# EasyEDA Pro project SKYSTAR.eprj

# Schematic Schematic1
Board Name: Board1; Create Date: 2025-07-10; Page Name: P1; Project Name: SKYSTAR; Schematic Name: Schematic1; Update Date: 2025-07-25; Company: 嘉立创EDA; Page Size: A4; Version: V1.0
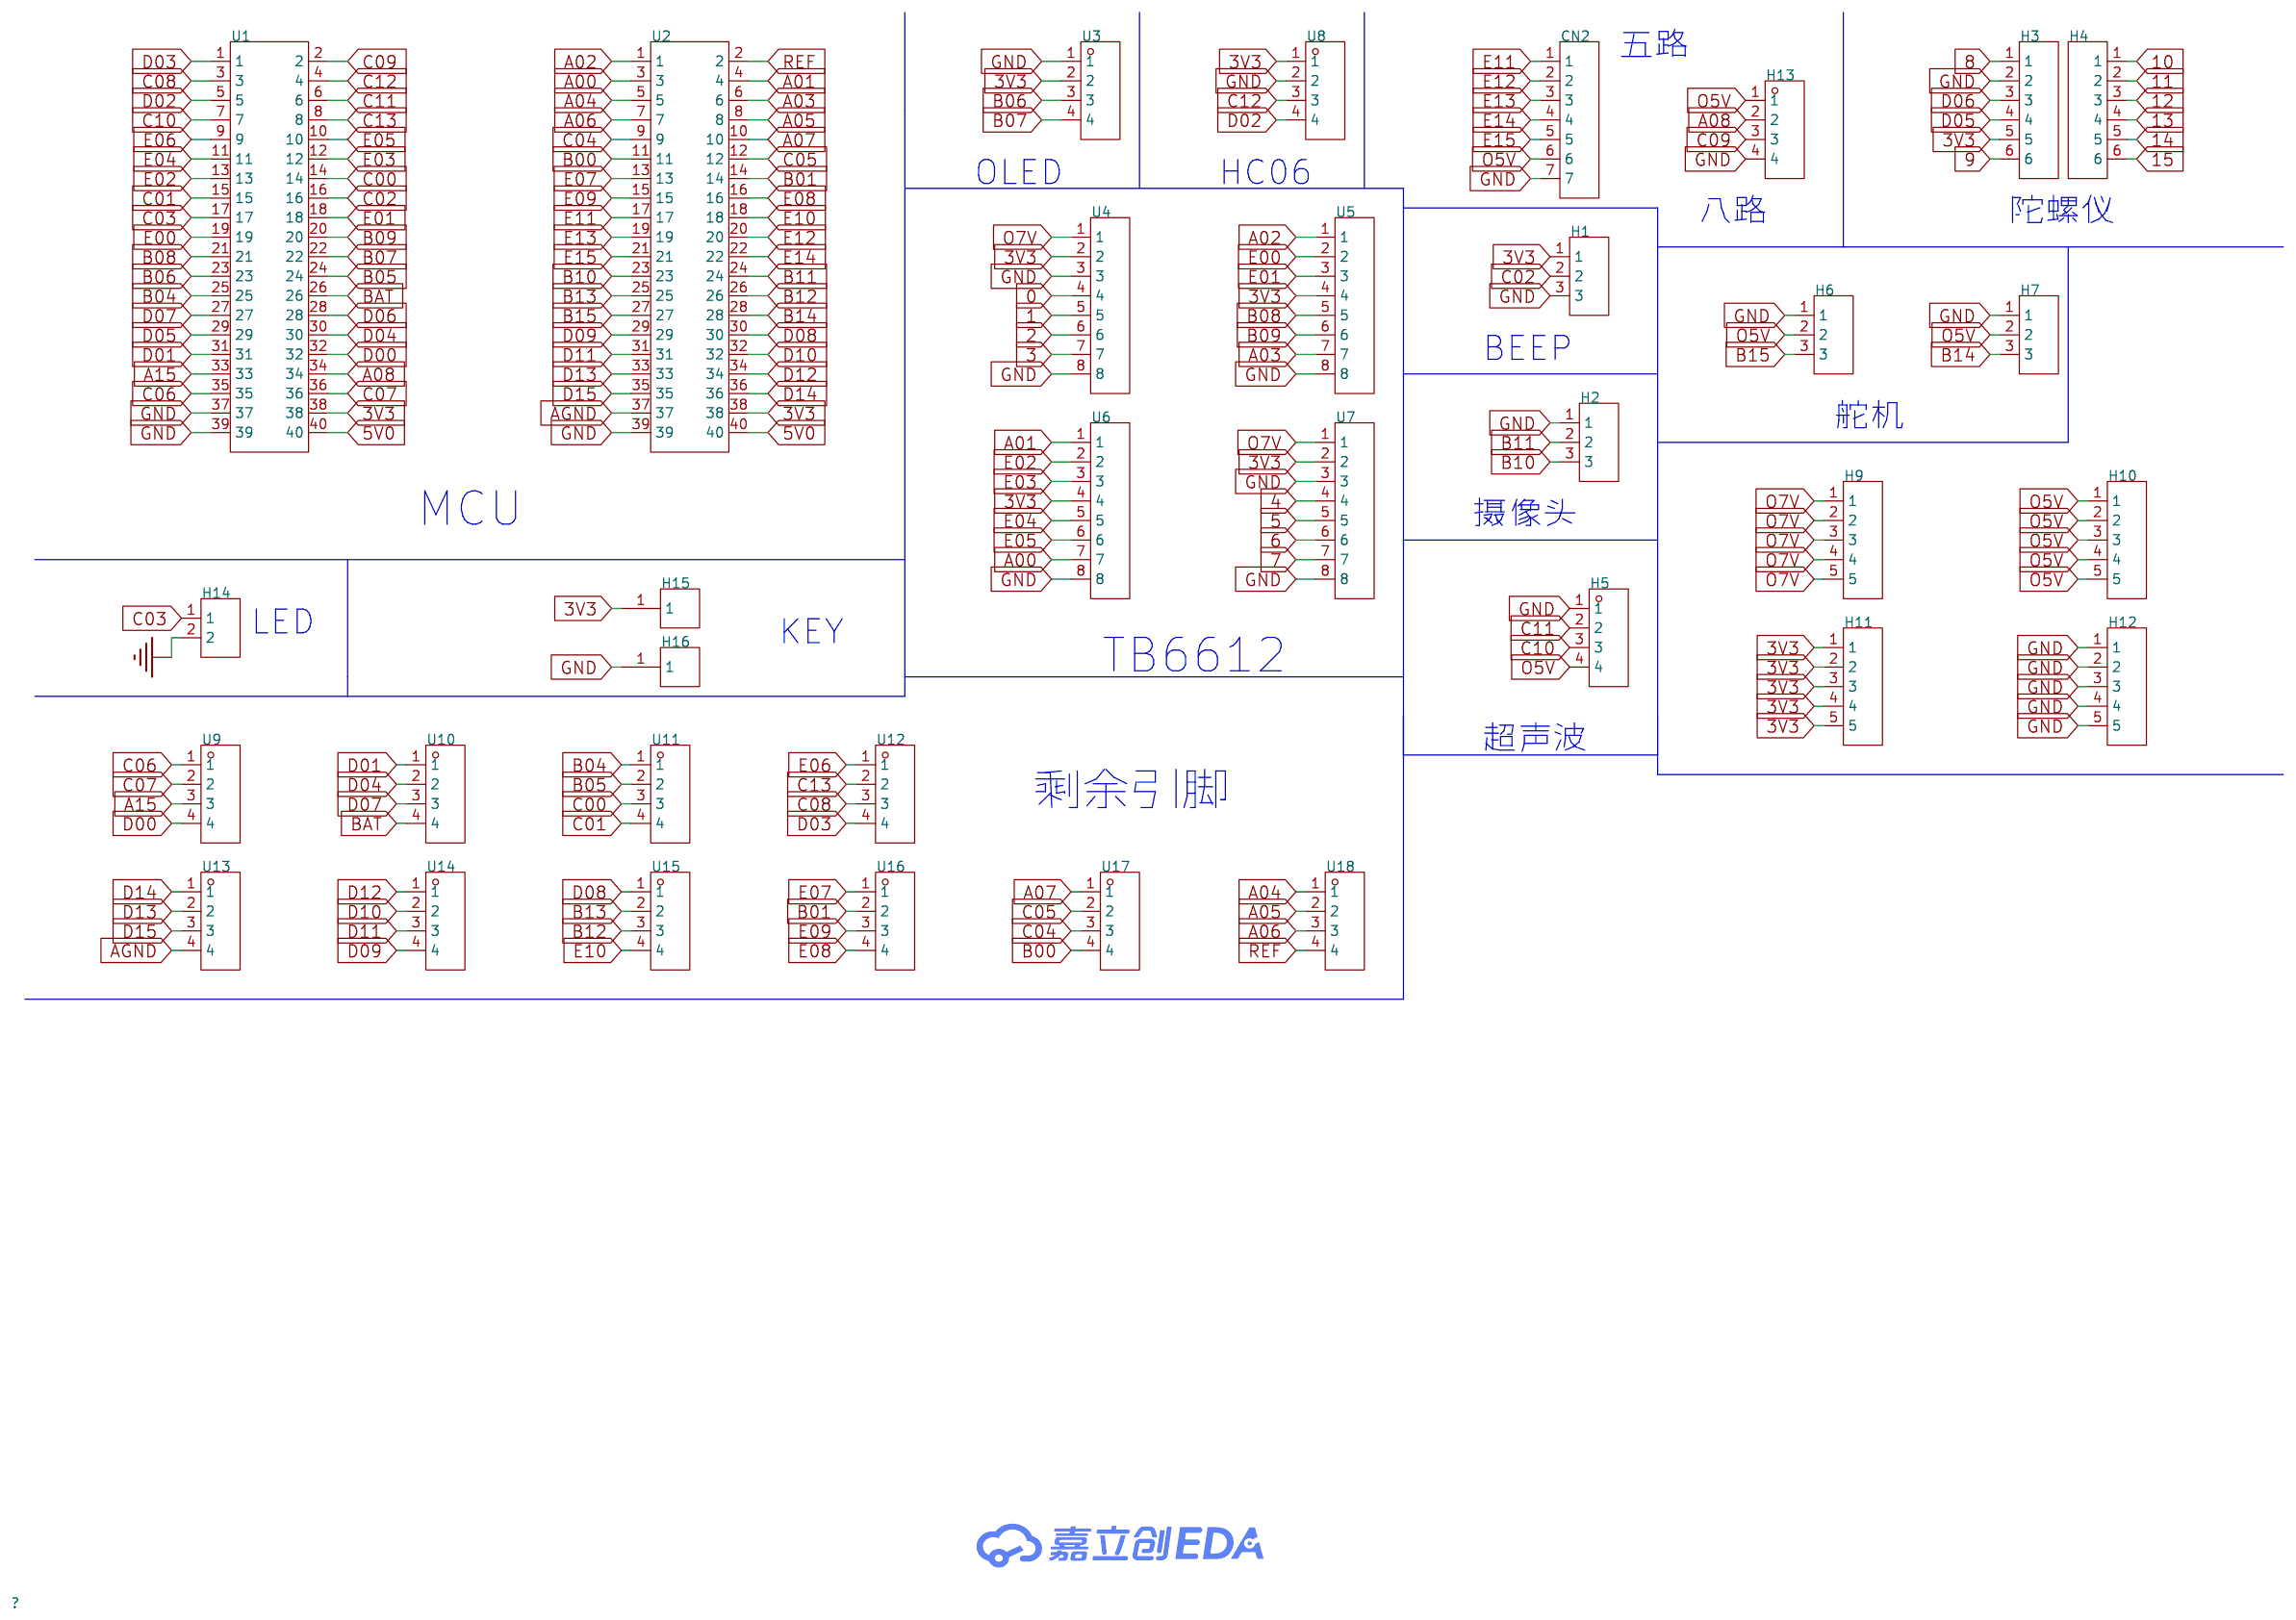
[diagram p0: schematic sheet]

## Parts
CN2  DB2ERC-2.54-7P-GN  [CONN-TH_7P-P2.54_DIBO_DB2ERC-2.54-7P-GN]
H1  PZ254V-11-03P  [HDR-TH_3P-P2.54-V-M]
H2  PZ254V-11-03P  [HDR-TH_3P-P2.54-V-M]
H3  PZ254V-11-06P  [HDR-TH_6P-P2.54-V-M]
H4  PZ254V-11-06P  [HDR-TH_6P-P2.54-V-M]
H5  PZ254V-11-04P  [HDR-TH_4P-P2.54-V-M]
H6  PZ254V-11-03P  [HDR-TH_3P-P2.54-V-M]
H7  PZ254V-11-03P  [HDR-TH_3P-P2.54-V-M]
H9  PZ254V-11-05P  [HDR-TH_5P-P2.54-V-M]
H10  PZ254V-11-05P  [HDR-TH_5P-P2.54-V-M]
H11  PZ254V-11-05P  [HDR-TH_5P-P2.54-V-M]
H12  PZ254V-11-05P  [HDR-TH_5P-P2.54-V-M]
H13  PZ254V-11-04P  [HDR-TH_4P-P2.54-V-M]
H14  PZ254V-11-02P  [HDR-TH_2P-P2.54-V-M]
H15  PZ254V-11-01P  [HDR-TH_1P-P2.54-V-M]
H16  PZ254V-11-01P  [HDR-TH_1P-P2.54-V-M]
U1  PZ2.54-2*20  [HDR-TH_40P-P2.54-V-M-R2-C20-S2.54]
U2  PZ2.54-2*20  [HDR-TH_40P-P2.54-V-M-R2-C20-S2.54]
U3  SIP4-CON4排针  [HDR-TH_4P-P2.54-V-M-3]
U4  2.54-1*8  [HDR-TH_8P-P2.54-V-M]
U5  2.54-1*8  [HDR-TH_8P-P2.54-V-M]
U6  2.54-1*8  [HDR-TH_8P-P2.54-V-M]
U7  2.54-1*8  [HDR-TH_8P-P2.54-V-M]
U8  SIP4-CON4排针  [HDR-TH_4P-P2.54-V-M-3]
U9  SIP4-CON4排针  [HDR-TH_4P-P2.54-V-M-3]
U10  SIP4-CON4排针  [HDR-TH_4P-P2.54-V-M-3]
U11  SIP4-CON4排针  [HDR-TH_4P-P2.54-V-M-3]
U12  SIP4-CON4排针  [HDR-TH_4P-P2.54-V-M-3]
U13  SIP4-CON4排针  [HDR-TH_4P-P2.54-V-M-3]
U14  SIP4-CON4排针  [HDR-TH_4P-P2.54-V-M-3]
U15  SIP4-CON4排针  [HDR-TH_4P-P2.54-V-M-3]
U16  SIP4-CON4排针  [HDR-TH_4P-P2.54-V-M-3]
U17  SIP4-CON4排针  [HDR-TH_4P-P2.54-V-M-3]
U18  SIP4-CON4排针  [HDR-TH_4P-P2.54-V-M-3]

## Library data of the parts
CN2 = DB2ERC-2.54-7P-GN: LCSC Part Name: 2.54mm 1x7P 排数:1 每排P数:7; Supplier Part: C2927508; Manufacturer: DORABO(地博电气); Supplier Footprint: 弯插,P=2.54mm; JLCPCB Part Class: 扩展库; Datasheet: https://atta.szlcsc.com/upload/public/pdf/source/20230321/910C409D9BDC2B7494BE314CD29A7494.pdf; Supplier: LCSC; Connector Type: 板端/插座-闭口; Number of Positions or Pins: 1x7P; Pitch: 2.54mm; Color: 绿色; Mounting Type: 弯针; Number of Pins: 7P; Number of Rows: 1; Number of PINs Per Row: 7; Current Rating: 5A; Voltage Rating (Max): 150V; Operating Temperature: -40℃~+105℃
H1 H2 H6 H7 = PZ254V-11-03P: LCSC Part Name: 1x3P 间距:2.54mm 方针 直插; Supplier Part: C2937625; Manufacturer: XFCN(兴飞); Supplier Footprint: 插件,P=2.54mm; JLCPCB Part Class: 扩展库; Datasheet: https://atta.szlcsc.com/upload/public/pdf/source/20200309/C492402_8335C3D49C4E4C618838D59BB1D024C1.pdf; Supplier: LCSC; Pin Structure: 1x3P; Pitch: 2.54mm; Circluar Pins/Square Pins: 方针; Mounting Type: 直插; Number of Rows: 单排; Number of Pins: 3P; Current Rating: 3A; Voltage Rating (Max): 250V; Length of Mating Pin: 6mm; Insulation Height: 2.5mm; Length of End Connection Pin: 3mm; Operating Temperature: -40℃~+105℃; Color: 黑色
H3 H4 = PZ254V-11-06P: LCSC Part Name: 1x6P 间距:2.54mm 方针 直插; Supplier Part: C492405; Manufacturer: XFCN(兴飞); Supplier Footprint: 插件,P=2.54mm; JLCPCB Part Class: 扩展库; Datasheet: https://atta.szlcsc.com/upload/public/pdf/source/20200309/C492405_597F1930F5B55CC3C7FD95458F1C3977.pdf; Supplier: LCSC; Pin Structure: 1x6P; Pitch: 2.54mm; Circluar Pins/Square Pins: 方针; Mounting Type: 直插; Number of Rows: 单排; Number of Pins: 6P; Length of Mating Pin: 6mm; Insulation Height: 2.5mm; Length of End Connection Pin: 3mm; Contact Material: 黄铜; Operating Temperature: -40℃~+105℃; Color: 黑色
H5 H13 = PZ254V-11-04P: LCSC Part Name: 间距:2.54mm 1x4P 直插 方针; Supplier Part: C2691448; Manufacturer: XFCN(兴飞); Supplier Footprint: 插件,P=2.54mm; JLCPCB Part Class: 扩展库; Datasheet: https://atta.szlcsc.com/upload/public/pdf/source/20200309/C492403_F9F19131791D08044AD4F84F8E751A34.pdf; Supplier: LCSC; Pin Structure: 1x4P; Pitch: 2.54mm; Circluar Pins/Square Pins: 方针; Mounting Type: 直插; Number of Rows: 单排; Number of Pins: 4P; Current Rating (Max): 3A; Voltage Rating (Max): 250V; Length of Mating Pin: 6mm; Insulation Height: 2.5mm; Length of End Connection Pin: 3mm; Operating Temperature Range: -40℃~+105℃; Color: 黑色
H9-H12 = PZ254V-11-05P: LCSC Part Name: 1x5P 间距:2.54mm 方针 直插; Supplier Part: C492404; Manufacturer: XFCN(兴飞); Supplier Footprint: 插件,P=2.54mm; JLCPCB Part Class: 扩展库; Datasheet: https://atta.szlcsc.com/upload/public/pdf/source/20200309/C492404_E51533260F8710EFF5D4617281164C1D.pdf; Supplier: LCSC; Pin Structure: 1x5P; Pitch: 2.54mm; Circluar Pins/Square Pins: 方针; Mounting Type: 直插; Number of Rows: 单排; Number of Pins: 5P; Length of Mating Pin: 6mm; Insulation Height: 2.5mm; Length of End Connection Pin: 3mm; Contact Material: 黄铜; Operating Temperature: -40℃~+105℃; Color: 黑色
H14 = PZ254V-11-02P: LCSC Part Name: 1x2P 间距:2.54mm 方针 直插; Supplier Part: C492401; Manufacturer: XFCN(兴飞); Supplier Footprint: 插件,P=2.54mm; JLCPCB Part Class: 扩展库; Datasheet: https://atta.szlcsc.com/upload/public/pdf/source/20200309/C492401_A812433581A9B211A7FFA413ADDFF0E5.pdf; Supplier: LCSC; Pin Structure: 1x2P; Pitch: 2.54mm; Circluar Pins/Square Pins: 方针; Mounting Type: 直插; Number of Rows: 单排; Number of Pins: 2P; Length of Mating Pin: 6mm; Insulation Height: 2.5mm; Length of End Connection Pin: 3mm; Contact Material: 黄铜; Operating Temperature: -40℃~+105℃; Color: 黑色
H15 H16 = PZ254V-11-01P: LCSC Part Name: 1x1P 间距:2.54mm 方针 直插; Supplier Part: C492400; Manufacturer: XFCN(兴飞); Supplier Footprint: 插件,P=2.54mm; JLCPCB Part Class: 扩展库; Datasheet: https://atta.szlcsc.com/upload/public/pdf/source/20200309/C492400_46876A5B545F5AE6B8D4A09C46E276E8.pdf; Supplier: LCSC; Pin Structure: 1x1P; Pitch: 2.54mm; Circluar Pins/Square Pins: 方针; Mounting Type: 直插; Number of Rows: 单排; Number of Pins: 1P; Length of Mating Pin: 6mm; Insulation Height: 2.5mm; Length of End Connection Pin: 3mm; Contact Material: 黄铜; Operating Temperature: -40℃~+105℃; Color: 黑色
U1 U2 = PZ2.54-2*20: LCSC Part Name: 2x20P 间距:2.54mm 直插; Supplier Part: C5224014; Manufacturer: ZHOURI(洲日); Supplier Footprint: 插件,P=2.54mm; JLCPCB Part Class: 扩展库; Datasheet: https://atta.szlcsc.com/upload/public/pdf/source/20221102/7E8316C38DB6D81BB18273F4CFF8B2F6.pdf; Supplier: LCSC; Pin Structure: 2x20P; Pitch: 2.54mm; Mounting Type: 直插; Number of Rows: 双排; Number of Pins: 40P; Contact Plating: 金
U3 U8-U18 = SIP4-CON4排针: Supplier Part: C9900002129; Supplier Footprint: SIP-4_2.54X10.16X2.54P; JLCPCB Part Class: 扩展库; Supplier: LCSC
U4-U7 = 2.54-1*8: Supplier Part: C5156616; Manufacturer: ZHOURI(洲日); Supplier Footprint: 插件,P=2.54mm; JLCPCB Part Class: 扩展库; Datasheet: https://atta.szlcsc.com/upload/public/pdf/source/20250227/F941FC765EF241ABFB2D5D72948A31A5.pdf; Supplier: LCSC; Pin Structure: 1x8P; Pitch: 2.54mm; Number of Rows: 单排; Number of Pins: 8P

## Nets
3V3: H1.1 H3.5 H11.1 H11.2 H11.3 H11.4 H11.5 H15.1 U1.38 U2.38 U3.2 U4.2 U5.4 U6.4 U7.2 U8.1
5V0: U1.40 U2.40
AGND: U2.37 U13.4
GND: CN2.7 H1.3 H2.1 H3.2 H5.1 H6.1 H7.1 H12.1 H12.2 H12.3 H12.4 H12.5 H13.4 H14.2 H16.1 U1.37 U1.39 U2.39 U3.1 U4.3 U4.8 U5.8 U6.8 U7.3 U7.8 U8.2
0: U4.4
1: U4.5
2: U4.6
3: U4.7
4: U7.4
5: U7.5
6: U7.6
7: U7.7
8: H3.1
9: H3.6
10: H4.1
11: H4.2
12: H4.3
13: H4.4
14: H4.5
15: H4.6
A00: U2.3 U6.7
A01: U2.4 U6.1
A02: U2.1 U5.1
A03: U2.6 U5.7
A04: U2.5 U18.1
A05: U2.8 U18.2
A06: U2.7 U18.3
A07: U2.10 U17.1
A08: H13.2 U1.34
A15: U1.33 U9.3
B00: U2.11 U17.4
B01: U2.14 U16.2
B04: U1.25 U11.1
B05: U1.24 U11.2
B06: U1.23 U3.3
B07: U1.22 U3.4
B08: U1.21 U5.5
B09: U1.20 U5.6
B10: H2.3 U2.23
B11: H2.2 U2.24
B12: U2.26 U15.3
B13: U2.25 U15.2
B14: H7.3 U2.28
B15: H6.3 U2.27
BAT: U1.26 U10.4
C00: U1.14 U11.3
C01: U1.15 U11.4
C02: H1.2 U1.16
C03: H14.1 U1.17
C04: U2.9 U17.3
C05: U2.12 U17.2
C06: U1.35 U9.1
C07: U1.36 U9.2
C08: U1.3 U12.3
C09: H13.3 U1.2
C10: H5.3 U1.7
C11: H5.2 U1.6
C12: U1.4 U8.3
C13: U1.8 U12.2
D00: U1.32 U9.4
D01: U1.31 U10.1
D02: U1.5 U8.4
D03: U1.1 U12.4
D04: U1.30 U10.2
D05: H3.4 U1.29
D06: H3.3 U1.28
D07: U1.27 U10.3
D08: U2.30 U15.1
D09: U2.29 U14.4
D10: U2.32 U14.2
D11: U2.31 U14.3
D12: U2.34 U14.1
D13: U2.33 U13.2
D14: U2.36 U13.1
D15: U2.35 U13.3
E00: U1.19 U5.2
E01: U1.18 U5.3
E02: U1.13 U6.2
E03: U1.12 U6.3
E04: U1.11 U6.5
E05: U1.10 U6.6
E06: U1.9 U12.1
E07: U2.13 U16.1
E08: U2.16 U16.4
E09: U2.15 U16.3
E10: U2.18 U15.4
E11: CN2.1 U2.17
E12: CN2.2 U2.20
E13: CN2.3 U2.19
E14: CN2.4 U2.22
E15: CN2.5 U2.21
O5V: CN2.6 H5.4 H6.2 H7.2 H10.1 H10.2 H10.3 H10.4 H10.5 H13.1
O7V: H9.1 H9.2 H9.3 H9.4 H9.5 U4.1 U7.1
REF: U2.2 U18.4

## Notes on the sheet
- 五路
- OLED
- HC06
- 八路
- 陀螺仪
- BEEP
- 舵机
- MCU
- 摄像头
- LED
- KEY
- TB6612
- 超声波
- 剩余引脚

# Board PCB1
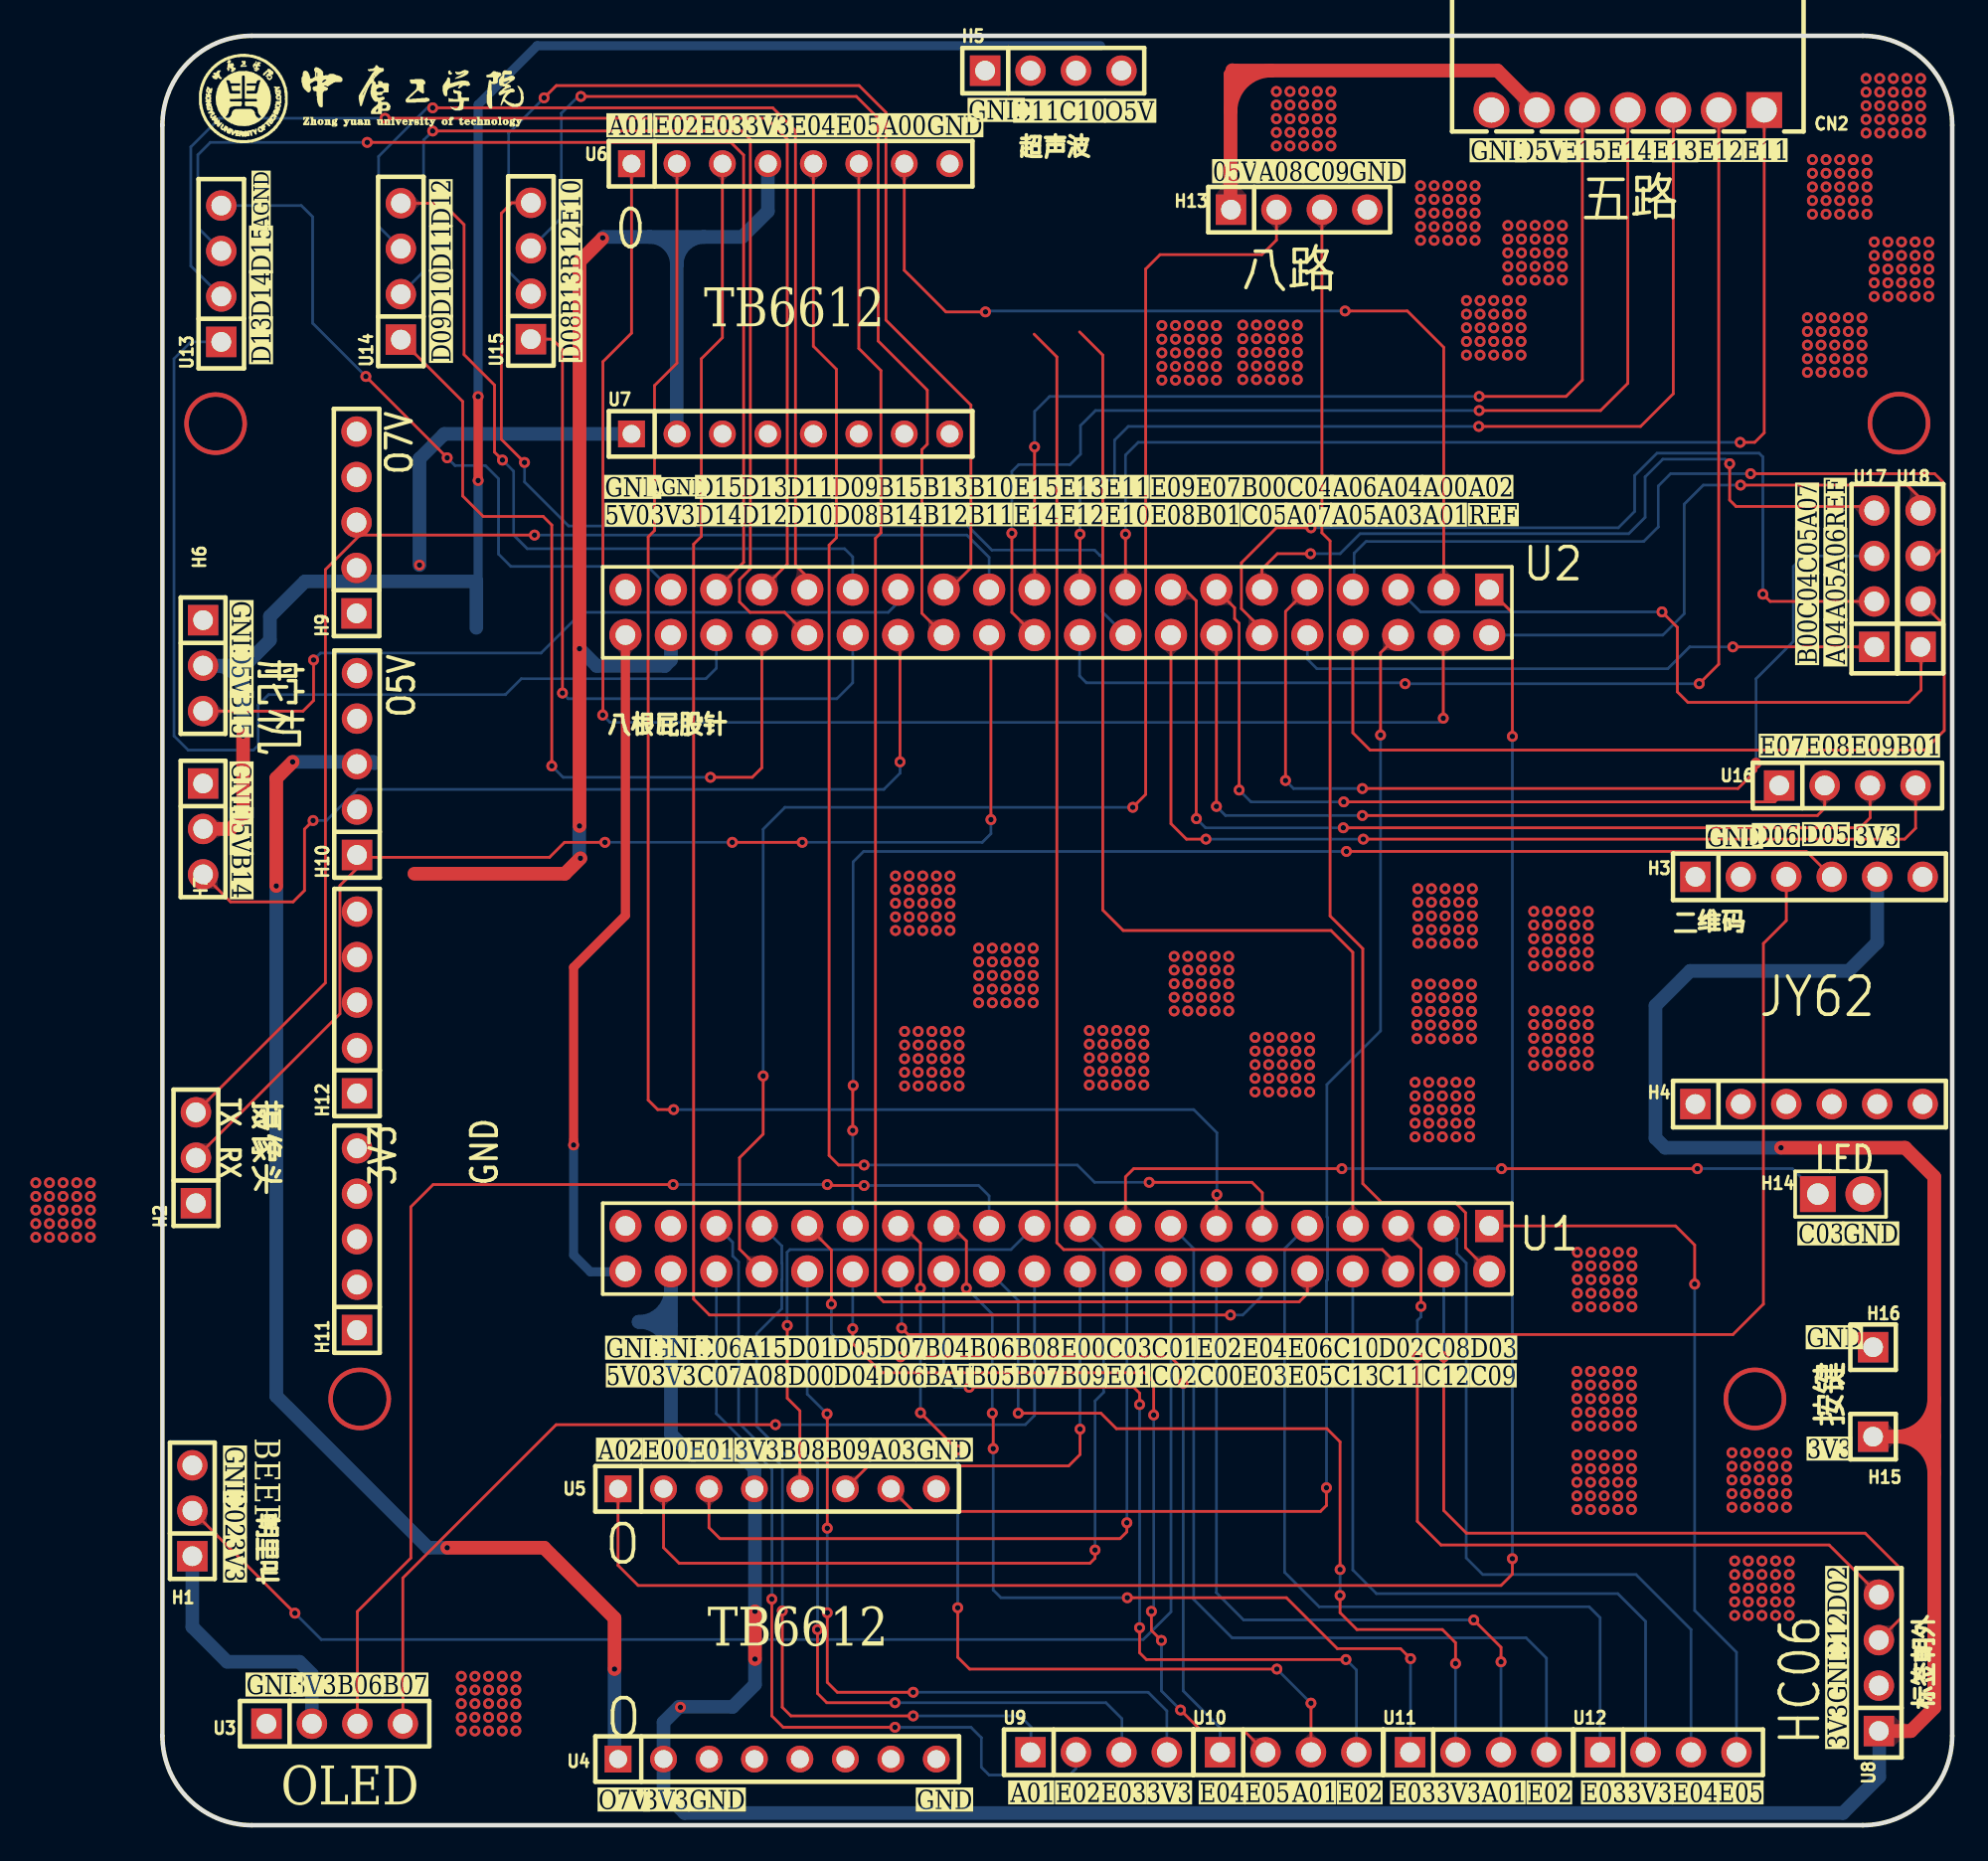
[diagram p1: board, top side]
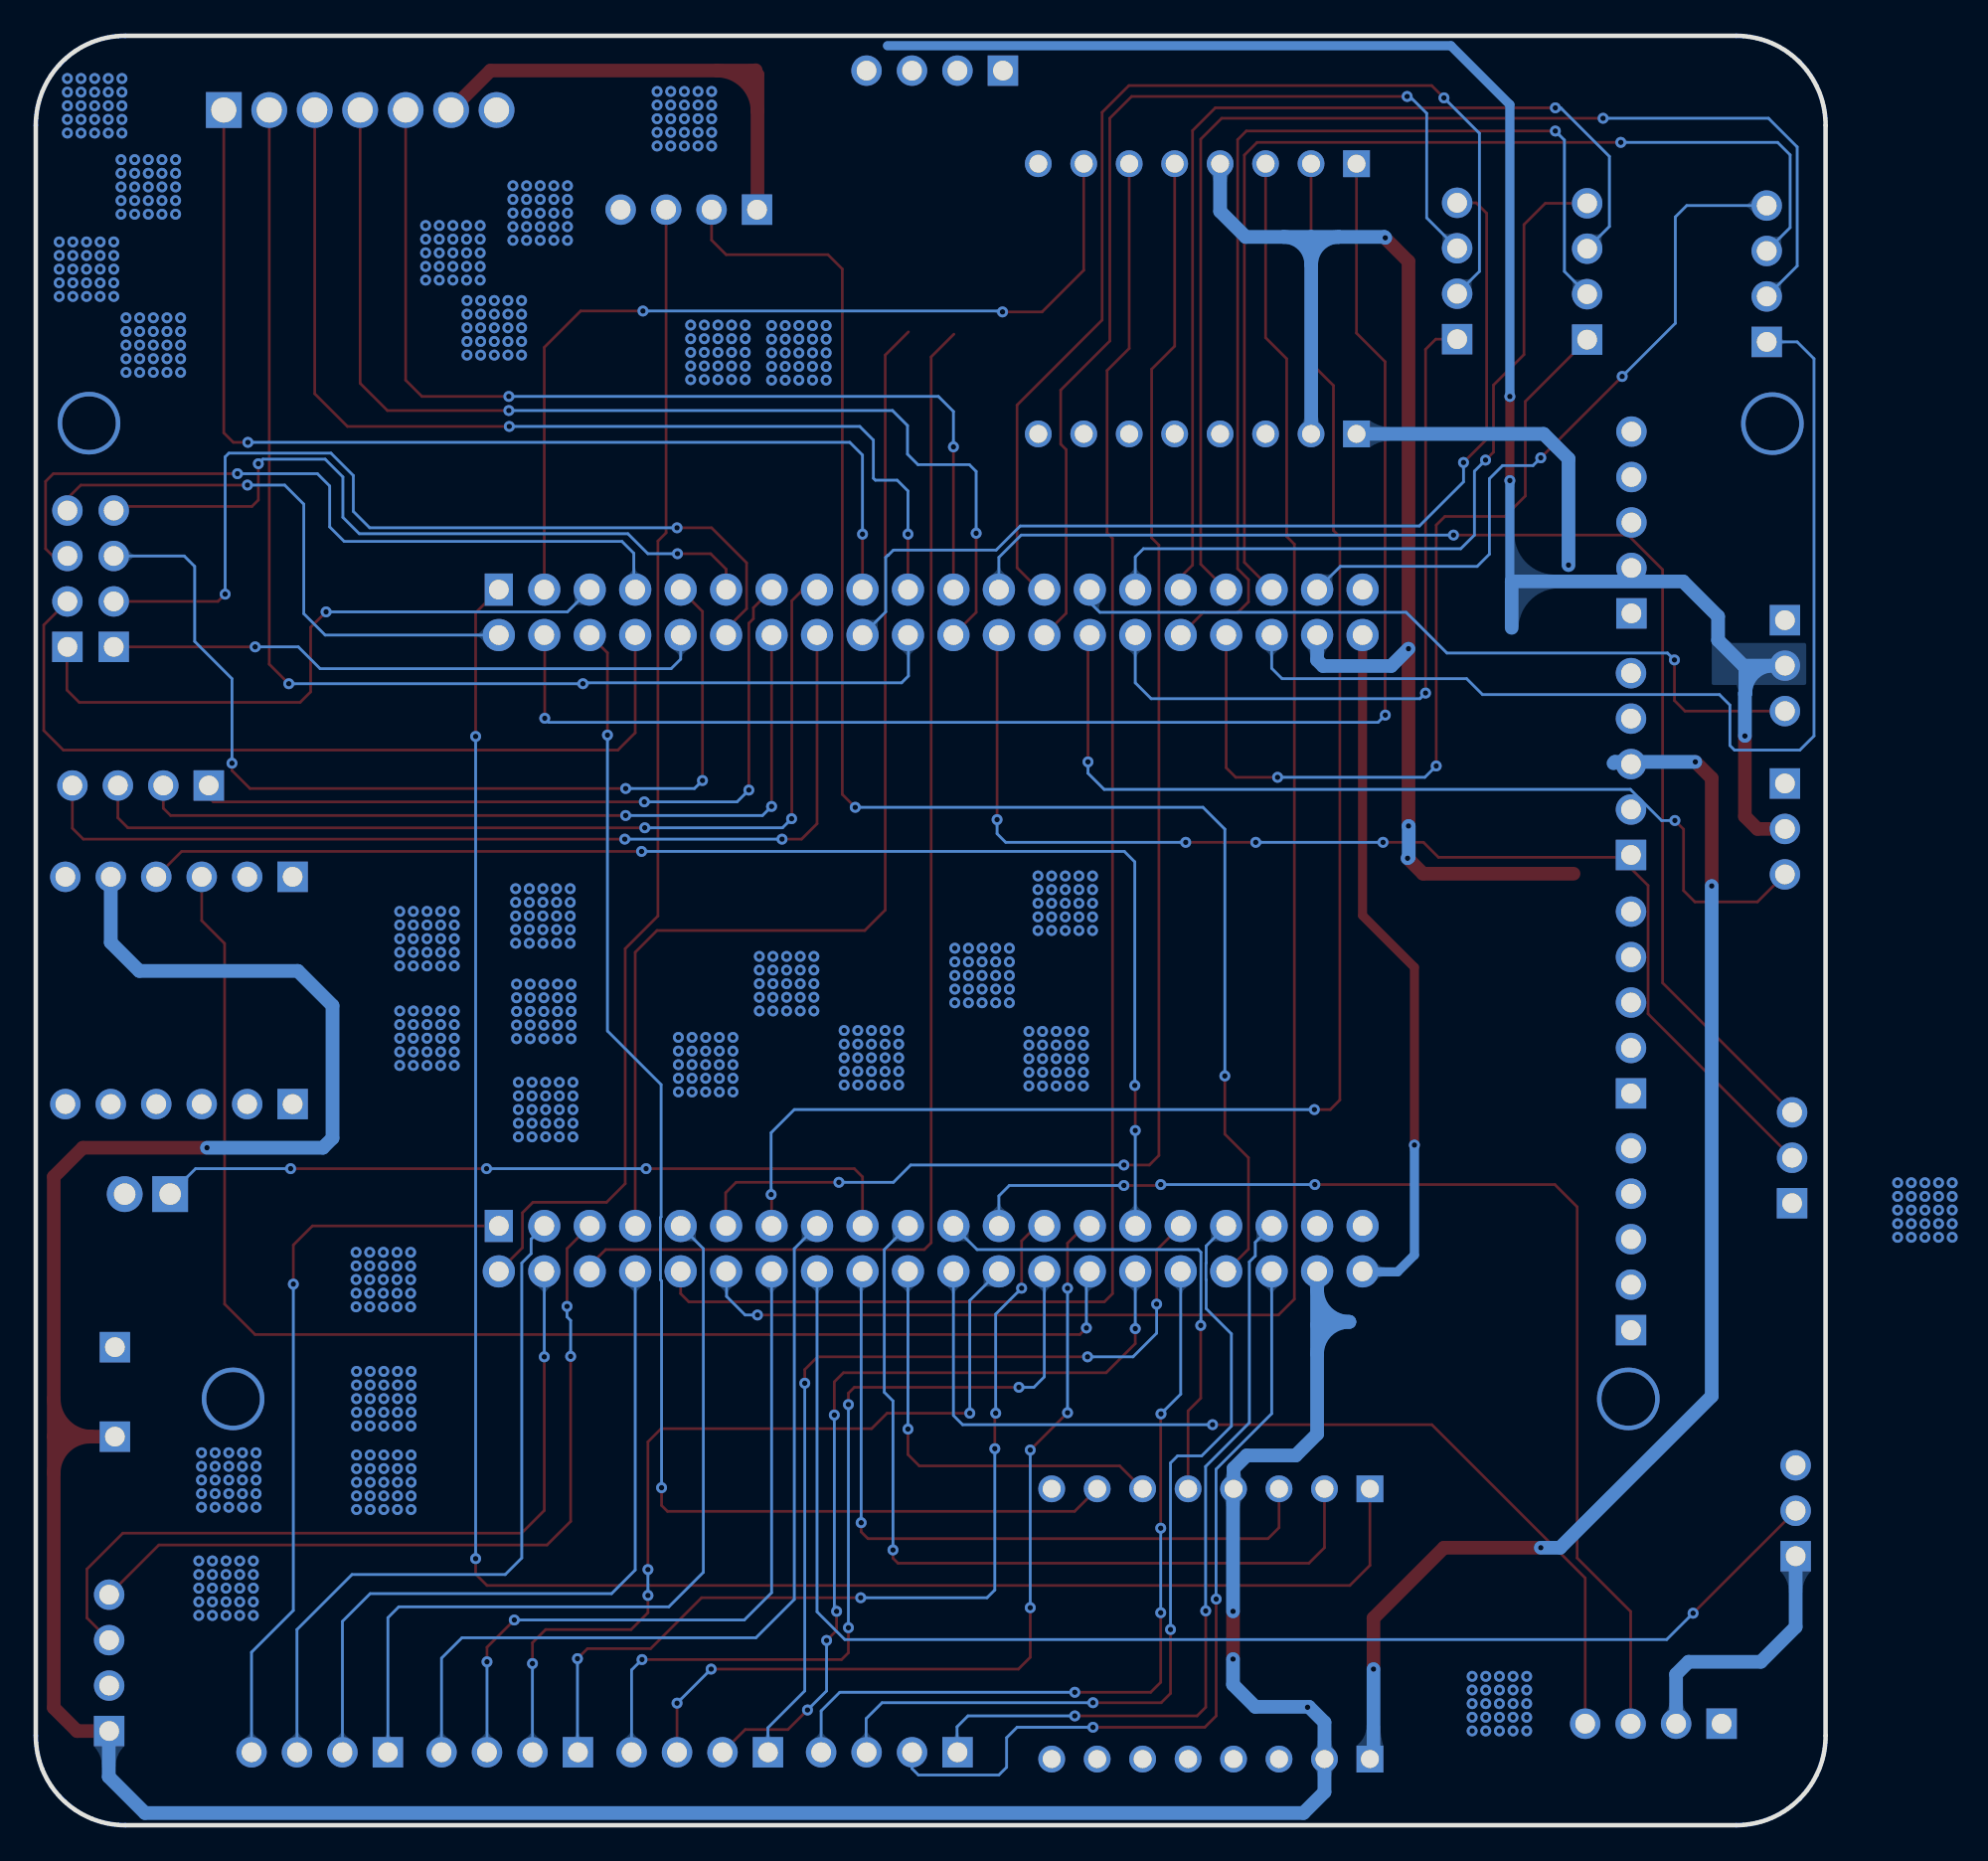
[diagram p2: board, bottom side, seen from below]

Outline 100 x 100 mm; copper layers: Top Layer, Bottom Layer. Coordinates in mm from the lower left corner of the outline.
Outline path: 0,95 arc(1.46,98.54) 5,100 95,100 arc(98.54,98.54) 100,95 100,5 arc(98.54,1.46) 95,0 5,0 arc(1.46,1.46) 0,5 0,95
Stack: Top Layer 0.035mm / Dielectric1 1.51mm FR4 er 4.5 / Bottom Layer 0.035mm

## Design rules (mm)
template: 自定义配置
spacing copperThickness1oz (default): track to track 0.102, other pairs 0.152 to 0.3
spacing copperThickness2oz: track to track 0.203, other pairs 0.152 to 0.3
track width copperThickness1oz (default): min 0.127, default 0.254, max 2.54
track width copperThickness2oz: min 0.203, default 0.254, max 2.54
differential pair differentialPair (default): width min 0.127, default 0.254, max 2.54; gap min 0.152, default 0.152
via viaSize (default): diameter min 0.5, default 0.61, max 10; hole min 0.3, default 0.305, max 6.3

## Placement (name value [footprint] x y rotation side)
CN2  DB2ERC-2.54-7P-GN  [CONN-TH_7P-P2.54_DIBO_DB2ERC-2.54-7P-GN]  81.88 95.85 180 top
H1  PZ254V-11-03P  [HDR-TH_3P-P2.54-V-M]  1.67 17.57 90 top
H2  PZ254V-11-03P  [HDR-TH_3P-P2.54-V-M]  1.87 37.3 90 top
H3  PZ254V-11-06P  [HDR-TH_6P-P2.54-V-M]  92 53 0 top
H4  PZ254V-11-06P  [HDR-TH_6P-P2.54-V-M]  92 40.3 0 top
H5  PZ254V-11-04P  [HDR-TH_4P-P2.54-V-M]  49.78 98.05 0 top
H6  PZ254V-11-03P  [HDR-TH_3P-P2.54-V-M]  2.27 64.8 270 top
H7  PZ254V-11-03P  [HDR-TH_3P-P2.54-V-M]  2.27 55.68 270 top
H9  PZ254V-11-05P  [HDR-TH_5P-P2.54-V-M]  10.85 72.8 90 top
H10  PZ254V-11-05P  [HDR-TH_5P-P2.54-V-M]  10.87 59.3 90 top
H11  PZ254V-11-05P  [HDR-TH_5P-P2.54-V-M]  10.87 32.75 90 top
H12  PZ254V-11-05P  [HDR-TH_5P-P2.54-V-M]  10.87 45.97 90 top
H13  PZ254V-11-04P  [HDR-TH_4P-P2.54-V-M]  63.51 90.28 0 top
H14  PZ254V-11-02P  [HDR-TH_2P-P2.54-V-M]  93.76 35.27 0 top
H15  PZ254V-11-01P  [HDR-TH_1P-P2.54-V-M]  95.58 21.71 180 top
H16  PZ254V-11-01P  [HDR-TH_1P-P2.54-V-M]  95.58 26.71 180 top
U1  PZ2.54-2*20  [HDR-TH_40P-P2.54-V-M-R2-C20-S2.54]  50 32.22 180 top
U2  PZ2.54-2*20  [HDR-TH_40P-P2.54-V-M-R2-C20-S2.54]  50 67.78 180 top
U3  SIP4-CON4排针  [HDR-TH_4P-P2.54-V-M-3]  9.62 5.67 0 top
U4  2.54-1*8  [HDR-TH_8P-P2.54-V-M]  34.35 3.7 0 top
U5  2.54-1*8  [HDR-TH_8P-P2.54-V-M]  34.35 18.8 0 top
U6  2.54-1*8  [HDR-TH_8P-P2.54-V-M]  35.1 92.85 0 top
U7  2.54-1*8  [HDR-TH_8P-P2.54-V-M]  35.1 77.75 0 top
U8  SIP4-CON4排针  [HDR-TH_4P-P2.54-V-M-3]  95.9 9.07 90 top
U9  SIP4-CON4排针  [HDR-TH_4P-P2.54-V-M-3]  52.31 4.08 0 top
U10  SIP4-CON4排针  [HDR-TH_4P-P2.54-V-M-3]  62.9 4.08 0 top
U11  SIP4-CON4排针  [HDR-TH_4P-P2.54-V-M-3]  73.52 4.08 0 top
U12  SIP4-CON4排针  [HDR-TH_4P-P2.54-V-M-3]  84.14 4.08 0 top
U13  SIP4-CON4排针  [HDR-TH_4P-P2.54-V-M-3]  3.29 86.7 90 top
U14  SIP4-CON4排针  [HDR-TH_4P-P2.54-V-M-3]  13.32 86.83 90 top
U15  SIP4-CON4排针  [HDR-TH_4P-P2.54-V-M-3]  20.59 86.86 90 top
U16  SIP4-CON4排针  [HDR-TH_4P-P2.54-V-M-3]  94.15 58.1 0 top
U17  SIP4-CON4排针  [HDR-TH_4P-P2.54-V-M-3]  95.64 69.66 90 top
U18  SIP4-CON4排针  [HDR-TH_4P-P2.54-V-M-3]  98.23 69.66 90 top

## Footprints (pads in the part's own frame, mm; a bottom-side part is the same pattern mirrored in y, then rotated)
CONN-TH_7P-P2.54_DIBO_DB2ERC-2.54-7P-GN
  rect 2x2 hole 1.4: 1(-7.62,0)
  round 2 hole 1.4: 2(-5.08,0) 3(-2.54,0) 4(0,0) 5(2.54,0) 6(5.08,0) 7(7.62,0)
HDR-TH_1P-P2.54-V-M
  rect 1.7x1.7 hole 1.1: 1(0,0)
HDR-TH_2P-P2.54-V-M
  rect 2x2 hole 1.2: 1(-1.27,0)
  round 2 hole 1.2: 2(1.27,0)
HDR-TH_3P-P2.54-V-M
  rect 1.7x1.7 hole 1.1: 1(-2.54,0)
  round 1.7 hole 1.1: 2(0,0) 3(2.54,0)
HDR-TH_4P-P2.54-V-M
  rect 1.7x1.7 hole 1.1: 1(-3.81,0)
  round 1.7 hole 1.1: 2(-1.27,0) 3(1.27,0) 4(3.81,0)
HDR-TH_4P-P2.54-V-M-3
  rect 1.7x1.7 hole 1.1: 1(-3.81,0)
  round 1.7 hole 1.1: 2(-1.27,0) 3(1.27,0) 4(3.81,0)
HDR-TH_5P-P2.54-V-M
  rect 1.7x1.7 hole 1.1: 1(-5.08,0)
  round 1.7 hole 1.1: 2(-2.54,0) 3(0,0) 4(2.54,0) 5(5.08,0)
HDR-TH_6P-P2.54-V-M
  rect 1.7x1.7 hole 1.1: 1(-6.35,0)
  round 1.7 hole 1.1: 2(-3.81,0) 3(-1.27,0) 4(1.27,0) 5(3.81,0) 6(6.35,0)
HDR-TH_8P-P2.54-V-M
  rect 1.5x1.5 hole 1: 1(-8.89,0)
  round 1.5 hole 1: 2(-6.35,0) 3(-3.81,0) 4(-1.27,0) 5(1.27,0) 6(3.81,0) 7(6.35,0) 8(8.89,0)
HDR-TH_40P-P2.54-V-M-R2-C20-S2.54
  rect 1.575x1.8 hole 1.1: 1(-24.13,-1.27)
  round 1.8 hole 1.1: 2(-24.13,1.27) 3(-21.59,-1.27) 4(-21.59,1.27) 5(-19.05,-1.27) 6(-19.05,1.27) 7(-16.51,-1.27) 8(-16.51,1.27) 9(-13.97,-1.27) 10(-13.97,1.27) 11(-11.43,-1.27) 12(-11.43,1.27) 13(-8.89,-1.27) 14(-8.89,1.27) 15(-6.35,-1.27) 16(-6.35,1.27) 17(-3.81,-1.27) 18(-3.81,1.27) 19(-1.27,-1.27) 20(-1.27,1.27) 21(1.27,-1.27) 22(1.27,1.27) 23(3.81,-1.27) 24(3.81,1.27) 25(6.35,-1.27) 26(6.35,1.27) 27(8.89,-1.27) 28(8.89,1.27) 29(11.43,-1.27) 30(11.43,1.27) 31(13.97,-1.27) 32(13.97,1.27) 33(16.51,-1.27) 34(16.51,1.27) 35(19.05,-1.27) 36(19.05,1.27) 37(21.59,-1.27) 38(21.59,1.27) 39(24.13,-1.27) 40(24.13,1.27)

## Nets
As in the schematic.

## Via types
v1: diameter 3.5, hole 3, Top Layer to Bottom Layer, 4 vias
v2: diameter 0.61, hole 0.305, Top Layer to Bottom Layer, 841 vias

## Routing (per net, layer and track width the routed paths; a pad name or vN(x,y) marks a point on that pad's centre or on a via; arc(x,y) is an arc through that point)
3V3: length 295.2
  Top Layer w0.762: v2(23.3,55.84) v2(23.3,65.75) 23.3,87.39 24.57,88.66 ; 99,23.84 99,36.23 97.37,37.86 v2(90.44,37.86) ; 99,23.84 99,21.73 ; 99,23.84 arc(98.37,22.34) 96.87,21.71 ; U8.1 97.69,5.26 99,6.57 99,19.67 ; v2(33.11,9.28) v2(33.11,11.95) ; 99,21.73 98.98,21.71 96.96,21.71 ; 99,21.73 99,19.67 ; 96.87,21.71 96.96,21.71 ; 96.87,21.71 H15.1 ; 96.96,21.71 arc(98.4,21.12) 99,19.67 ; v2(23.36,54.04) 22.49,53.17 14.08,53.17
  Bottom Layer w0.762: 30.28,88.76 28.74,88.76 ; 30.28,88.76 32.4,88.76 33.83,90.19 U6.4 ; 30.28,88.76 arc(29.19,88.31) 28.74,87.22 ; 28.74,88.76 28.74,87.22 ; 28.74,88.76 27.2,88.76 ; 26.61,28.13 28.24,28.13 28.41,27.96 ; 26.61,28.13 arc(27.88,28.66) 28.41,29.93 ; 26.61,28.13 arc(27.88,27.6) 28.41,26.33 ; U2.38 28.41,65.11 28.08,64.78 24.27,64.78 v2(23.3,65.75) ; v2(23.3,55.84) 23.29,55.83 23.29,54.1 v2(23.36,54.04) ; v2(24.6,88.71) 24.65,88.76 27.2,88.76 ; U8.1 95.92,5.24 95.92,2.71 93.9,0.68 29.17,0.68 28,1.85 U4.2 28,5.75 28.87,6.62 31.86,6.62 33.11,7.86 v2(33.11,9.28) ; 28.74,87.22 28.74,77.76 U7.2 ; 28.74,87.22 arc(28.29,88.31) 27.2,88.76 ; 28.41,27.96 28.41,29.93 ; 28.41,27.96 28.41,26.33 ; 8.35,5.67 8.35,8.44 7.66,9.13 3.62,9.13 1.67,11.08 H1.1 ; 28.41,29.93 U1.38 ; 28.41,26.33 28.41,21.86 29.6,20.66 32.35,20.66 33.08,19.93 33.08,18.8 33.11,18.77 v2(33.11,11.95) ; H3.5 95.81,49.33 94.22,47.74 85.36,47.74 83.42,45.8 83.42,38.4 83.96,37.86 v2(90.44,37.86)
  vias: v2(28.94,6.59)
5V0: length 39.1
  Top Layer w0.508: U2.40 25.87,50.84 22.97,47.94 v2(22.97,38.01)
  Bottom Layer w0.508: U1.40 25.84,30.92 23.91,30.92 22.97,31.86 v2(22.97,38.01)
AGND: length 40
  Top Layer w0.152: v2(15.91,76.42) v2(11.37,80.96)
  Bottom Layer w0.152: v2(11.37,80.96) 8.39,83.93 8.39,89.88 7.76,90.51 U13.4 ; U2.37 27.11,70.35 19.47,70.35 18.78,71.03 18.78,75.25 18.05,75.98 16.34,75.98 v2(15.91,76.42)
GND: length 0.3
  Top Layer w0.762: 43.24,3.72 43.24,3.7 43.24,3.7 43.24,3.72 43.24,3.72 ; 43.24,3.72 43.21,3.76 ; 43.24,3.72 43.47,3.72
  vias: v2(-7.07,35.9) v2(-7.07,35.14) v2(-7.07,34.38) v2(-7.07,33.62) v2(-7.07,32.86) v2(-6.31,35.9) v2(-6.31,35.14) v2(-6.31,34.38) v2(-6.31,33.62) v2(-6.31,32.86) v2(-5.55,35.9) v2(-5.55,35.14) v2(-5.55,34.38) v2(-5.55,33.62) v2(-5.55,32.86) v2(-4.79,35.9) v2(-4.79,35.14) v2(-4.79,34.38) v2(-4.79,33.62) v2(-4.79,32.86) v2(-4.03,35.9) v2(-4.03,35.14) v2(-4.03,34.38) v2(-4.03,33.62) v2(-4.03,32.86) v2(16.7,8.32) v2(16.7,7.56) v2(16.7,6.79) v2(16.7,6.03) v2(16.7,5.27) v2(17.46,8.32) v2(17.46,7.56) v2(17.46,6.79) v2(17.46,6.03) v2(17.46,5.27) v2(18.22,8.32) v2(18.22,7.56) v2(18.22,6.79) v2(18.22,6.03) v2(18.22,5.27) v2(18.99,8.32) v2(18.99,7.56) v2(18.99,6.79) v2(18.99,6.03) v2(18.99,5.27) v2(19.75,8.32) v2(19.75,7.56) v2(19.75,6.79) v2(19.75,6.03) v2(19.75,5.27) v2(40.96,53.05) v2(40.96,52.29) v2(40.96,51.52) v2(40.96,50.76) v2(40.96,50) v2(41.47,44.36) v2(41.47,43.6) v2(41.47,42.84) v2(41.47,42.08) v2(41.47,41.31) v2(41.72,53.05) v2(41.72,52.29) v2(41.72,51.52) v2(41.72,50.76) v2(41.72,50) v2(42.23,44.36) v2(42.23,43.6) v2(42.23,42.84) v2(42.23,42.08) v2(42.23,41.31) v2(42.48,53.05) v2(42.48,52.29) v2(42.48,51.52) v2(42.48,50.76) v2(42.48,50) v2(42.99,44.36) v2(42.99,43.6) v2(42.99,42.84) v2(42.99,42.08) v2(42.99,41.31) v2(43.24,53.05) v2(43.24,52.29) v2(43.24,51.52) v2(43.24,50.76) v2(43.24,50) v2(43.75,44.36) v2(43.75,43.6) v2(43.75,42.84) v2(43.75,42.08) v2(43.75,41.31) v2(44.01,53.05) v2(44.01,52.29) v2(44.01,51.52) v2(44.01,50.76) v2(44.01,50) v2(44.51,44.36) v2(44.51,43.6) v2(44.51,42.84) v2(44.51,42.08) v2(44.51,41.31) v2(45.61,49.01) v2(45.61,48.25) v2(45.61,47.49) v2(45.61,46.72) v2(45.61,45.96) v2(46.37,49.01) v2(46.37,48.25) v2(46.37,47.49) v2(46.37,46.72) v2(46.37,45.96) v2(47.13,49.01) v2(47.13,48.25) v2(47.13,47.49) v2(47.13,46.72) v2(47.13,45.96) v2(47.89,49.01) v2(47.89,48.25) v2(47.89,47.49) v2(47.89,46.72) v2(47.89,45.96) v2(48.65,49.01) v2(48.65,48.25) v2(48.65,47.49) v2(48.65,46.72) v2(48.65,45.96) v2(51.79,44.41) v2(51.79,43.65) v2(51.79,42.89) v2(51.79,42.13) v2(51.79,41.36) v2(52.55,44.41) v2(52.55,43.65) v2(52.55,42.89) v2(52.55,42.13) v2(52.55,41.36) v2(53.31,44.41) v2(53.31,43.65) v2(53.31,42.89) v2(53.31,42.13) v2(53.31,41.36) v2(54.07,44.41) v2(54.07,43.65) v2(54.07,42.89) v2(54.07,42.13) v2(54.07,41.36) v2(54.84,44.41) v2(54.84,43.65) v2(54.84,42.89) v2(54.84,42.13) v2(54.84,41.36) v2(55.84,83.81) v2(55.84,83.05) v2(55.84,82.28) v2(55.84,81.52) v2(55.84,80.76) v2(56.53,48.55) v2(56.53,47.79) v2(56.53,47.03) v2(56.53,46.27) v2(56.53,45.5) v2(56.6,83.81) v2(56.6,83.05) v2(56.6,82.28) v2(56.6,81.52) v2(56.6,80.76) v2(57.29,48.55) v2(57.29,47.79) v2(57.29,47.03) v2(57.29,46.27) v2(57.29,45.5) v2(57.37,83.81) v2(57.37,83.05) v2(57.37,82.28) v2(57.37,81.52) v2(57.37,80.76) v2(58.13,83.81) v2(58.13,83.05) v2(58.13,82.28) v2(58.13,81.52) v2(58.13,80.76) v2(58.05,48.55) v2(58.05,47.79) v2(58.05,47.03) v2(58.05,46.27) v2(58.05,45.5) v2(58.81,48.55) v2(58.81,47.79) v2(58.81,47.03) v2(58.81,46.27) v2(58.81,45.5) v2(58.89,83.81) v2(58.89,83.05) v2(58.89,82.28) v2(58.89,81.52) v2(58.89,80.76) v2(59.58,48.55) v2(59.58,47.79) v2(59.58,47.03) v2(59.58,46.27) v2(59.58,45.5) v2(60.36,83.83) v2(60.36,83.07) v2(60.36,82.31) v2(60.36,81.55) v2(60.36,80.78) v2(61.05,44.03) v2(61.05,43.26) v2(61.05,42.5) v2(61.05,41.74) v2(61.05,40.98) v2(61.12,83.83) v2(61.12,83.07) v2(61.12,82.31) v2(61.12,81.55) v2(61.12,80.78) v2(61.81,44.03) v2(61.81,43.26) v2(61.81,42.5) v2(61.81,41.74) v2(61.81,40.98) v2(61.89,83.83) v2(61.89,83.07) v2(61.89,82.31) v2(61.89,81.55) v2(61.89,80.78) v2(62.24,96.89) v2(62.24,96.13) v2(62.24,95.36) v2(62.24,94.6) v2(62.24,93.84) v2(62.65,83.83) v2(62.65,83.07) v2(62.65,82.31) v2(62.65,81.55) v2(62.65,80.78) v2(62.57,44.03) v2(62.57,43.26) v2(62.57,42.5) v2(62.57,41.74) v2(62.57,40.98) v2(63,96.89) v2(63,96.13) v2(63,95.36) v2(63,94.6) v2(63,93.84) v2(63.34,44.03) v2(63.34,43.26) v2(63.34,42.5) v2(63.34,41.74) v2(63.34,40.98) v2(63.41,83.83) v2(63.41,83.07) v2(63.41,82.31) v2(63.41,81.55) v2(63.41,80.78) v2(63.76,96.89) v2(63.76,96.13) v2(63.76,95.36) v2(63.76,94.6) v2(63.76,93.84) v2(64.1,44.03) v2(64.1,43.26) v2(64.1,42.5) v2(64.1,41.74) v2(64.1,40.98) v2(64.53,96.89) v2(64.53,96.13) v2(64.53,95.36) v2(64.53,94.6) v2(64.53,93.84) v2(65.29,96.89) v2(65.29,96.13) v2(65.29,95.36) v2(65.29,94.6) v2(65.29,93.84) v2(69.99,41.52) v2(69.99,40.75) v2(69.99,39.99) v2(69.99,39.23) v2(69.99,38.47) v2(70.14,52.34) v2(70.14,51.57) v2(70.14,50.81) v2(70.14,50.05) v2(70.14,49.29) v2(70.09,47) v2(70.09,46.24) v2(70.09,45.48) v2(70.09,44.72) v2(70.09,43.95) v2(70.29,91.62) v2(70.29,90.86) v2(70.29,90.09) v2(70.29,89.33) v2(70.29,88.57) v2(70.75,41.52) v2(70.75,40.75) v2(70.75,39.99) v2(70.75,39.23) v2(70.75,38.47) v2(70.9,52.34) v2(70.9,51.57) v2(70.9,50.81) v2(70.9,50.05) v2(70.9,49.29) v2(70.85,47) v2(70.85,46.24) v2(70.85,45.48) v2(70.85,44.72) v2(70.85,43.95) v2(71.06,91.62) v2(71.06,90.86) v2(71.06,90.09) v2(71.06,89.33) v2(71.06,88.57) v2(71.51,41.52) v2(71.51,40.75) v2(71.51,39.99) v2(71.51,39.23) v2(71.51,38.47) v2(71.62,47) v2(71.62,46.24) v2(71.62,45.48) v2(71.62,44.72) v2(71.62,43.95) v2(71.67,52.34) v2(71.67,51.57) v2(71.67,50.81) v2(71.67,50.05) v2(71.67,49.29) v2(71.82,91.62) v2(71.82,90.86) v2(71.82,90.09) v2(71.82,89.33) v2(71.82,88.57) v2(72.28,41.52) v2(72.28,40.75) v2(72.28,39.99) v2(72.28,39.23) v2(72.28,38.47) v2(72.43,52.34) v2(72.43,51.57) v2(72.43,50.81) v2(72.43,50.05) v2(72.43,49.29) v2(72.38,47) v2(72.38,46.24) v2(72.38,45.48) v2(72.38,44.72) v2(72.38,43.95) v2(72.58,91.62) v2(72.58,90.86) v2(72.58,90.09) v2(72.58,89.33) v2(72.58,88.57) v2(72.86,85.2) v2(72.86,84.44) v2(72.86,83.68) v2(72.86,82.92) v2(72.86,82.16) v2(73.04,41.52) v2(73.04,40.75) v2(73.04,39.99) v2(73.04,39.23) v2(73.04,38.47) v2(73.14,47) v2(73.14,46.24) v2(73.14,45.48) v2(73.14,44.72) v2(73.14,43.95) v2(73.19,52.34) v2(73.19,51.57) v2(73.19,50.81) v2(73.19,50.05) v2(73.19,49.29) v2(73.34,91.62) v2(73.34,90.86) v2(73.34,90.09) v2(73.34,89.33) v2(73.34,88.57) v2(73.62,85.2) v2(73.62,84.44) v2(73.62,83.68) v2(73.62,82.92) v2(73.62,82.16) v2(74.38,85.2) v2(74.38,84.44) v2(74.38,83.68) v2(74.38,82.92) v2(74.38,82.16) v2(75.15,85.2) v2(75.15,84.44) v2(75.15,83.68) v2(75.15,82.92) v2(75.15,82.16) v2(75.17,89.4) v2(75.17,88.63) v2(75.17,87.87) v2(75.17,87.11) v2(75.17,86.35) v2(75.93,89.4) v2(75.93,88.63) v2(75.93,87.87) v2(75.93,87.11) v2(75.93,86.35) v2(75.91,85.2) v2(75.91,84.44) v2(75.91,83.68) v2(75.91,82.92) v2(75.91,82.16) v2(76.62,51.07) v2(76.62,50.3) v2(76.62,49.54) v2(76.62,48.78) v2(76.62,48.02) v2(76.62,45.5) v2(76.62,44.74) v2(76.62,43.98) v2(76.62,43.22) v2(76.62,42.46) v2(76.7,89.4) v2(76.7,88.63) v2(76.7,87.87) v2(76.7,87.11) v2(76.7,86.35) v2(77.38,51.07) v2(77.38,50.3) v2(77.38,49.54) v2(77.38,48.78) v2(77.38,48.02) v2(77.38,45.5) v2(77.38,44.74) v2(77.38,43.98) v2(77.38,43.22) v2(77.38,42.46) v2(77.46,89.4) v2(77.46,88.63) v2(77.46,87.87) v2(77.46,87.11) v2(77.46,86.35) v2(78.14,51.07) v2(78.14,50.3) v2(78.14,49.54) v2(78.14,48.78) v2(78.14,48.02) v2(78.14,45.5) v2(78.14,44.74) v2(78.14,43.98) v2(78.14,43.22) v2(78.14,42.46) v2(78.22,89.4) v2(78.22,88.63) v2(78.22,87.87) v2(78.22,87.11) v2(78.22,86.35) v2(78.91,51.07) v2(78.91,50.3) v2(78.91,49.54) v2(78.91,48.78) v2(78.91,48.02) v2(78.91,45.5) v2(78.91,44.74) v2(78.91,43.98) v2(78.91,43.22) v2(78.91,42.46) v2(79.03,25.36) v2(79.03,24.6) v2(79.03,23.84) v2(79.03,23.08) v2(79.03,22.31) v2(79.03,20.69) v2(79.03,19.93) v2(79.03,19.16) v2(79.03,18.4) v2(79.03,17.64) v2(79.06,32.02) v2(79.06,31.25) v2(79.06,30.49) v2(79.06,29.73) v2(79.06,28.97) v2(79.67,51.07) v2(79.67,50.3) v2(79.67,49.54) v2(79.67,48.78) v2(79.67,48.02) v2(79.67,45.5) v2(79.67,44.74) v2(79.67,43.98) v2(79.67,43.22) v2(79.67,42.46) v2(79.82,32.02) v2(79.82,31.25) v2(79.82,30.49) v2(79.82,29.73) v2(79.82,28.97) v2(79.79,25.36) v2(79.79,24.6) v2(79.79,23.84) v2(79.79,23.08) v2(79.79,22.31) v2(79.79,20.69) v2(79.79,19.93) v2(79.79,19.16) v2(79.79,18.4) v2(79.79,17.64) v2(80.58,32.02) v2(80.58,31.25) v2(80.58,30.49) v2(80.58,29.73) v2(80.58,28.97) v2(80.56,25.36) v2(80.56,24.6) v2(80.56,23.84) v2(80.56,23.08) v2(80.56,22.31) v2(80.56,20.69) v2(80.56,19.93) v2(80.56,19.16) v2(80.56,18.4) v2(80.56,17.64) v2(81.34,32.02) v2(81.34,31.25) v2(81.34,30.49) v2(81.34,29.73) v2(81.34,28.97) v2(81.32,25.36) v2(81.32,24.6) v2(81.32,23.84) v2(81.32,23.08) v2(81.32,22.31) v2(81.32,20.69) v2(81.32,19.93) v2(81.32,19.16) v2(81.32,18.4) v2(81.32,17.64) v2(82.11,32.02) v2(82.11,31.25) v2(82.11,30.49) v2(82.11,29.73) v2(82.11,28.97) v2(82.08,25.36) v2(82.08,24.6) v2(82.08,23.84) v2(82.08,23.08) v2(82.08,22.31) v2(82.08,20.69) v2(82.08,19.93) v2(82.08,19.16) v2(82.08,18.4) v2(82.08,17.64) v2(87.69,20.82) v2(87.69,20.05) v2(87.69,19.29) v2(87.69,18.53) v2(87.69,17.77) v2(87.85,14.77) v2(87.85,14.01) v2(87.85,13.25) v2(87.85,12.48) v2(87.85,11.72) v2(88.46,20.82) v2(88.46,20.05) v2(88.46,19.29) v2(88.46,18.53) v2(88.46,17.77) v2(88.61,14.77) v2(88.61,14.01) v2(88.61,13.25) v2(88.61,12.48) v2(88.61,11.72) v2(89.22,20.82) v2(89.22,20.05) v2(89.22,19.29) v2(89.22,18.53) v2(89.22,17.77) v2(89.37,14.77) v2(89.37,14.01) v2(89.37,13.25) v2(89.37,12.48) v2(89.37,11.72) v2(89.98,20.82) v2(89.98,20.05) v2(89.98,19.29) v2(89.98,18.53) v2(89.98,17.77) v2(90.13,14.77) v2(90.13,14.01) v2(90.13,13.25) v2(90.13,12.48) v2(90.13,11.72) v2(90.74,20.82) v2(90.74,20.05) v2(90.74,19.29) v2(90.74,18.53) v2(90.74,17.77) v2(90.89,14.77) v2(90.89,14.01) v2(90.89,13.25) v2(90.89,12.48) v2(90.89,11.72) v2(91.91,84.24) v2(91.91,83.48) v2(91.91,82.72) v2(91.91,81.95) v2(91.91,81.19) v2(92.19,93.08) v2(92.19,92.32) v2(92.19,91.55) v2(92.19,90.79) v2(92.19,90.03) v2(92.67,84.24) v2(92.67,83.48) v2(92.67,82.72) v2(92.67,81.95) v2(92.67,81.19) v2(92.95,93.08) v2(92.95,92.32) v2(92.95,91.55) v2(92.95,90.79) v2(92.95,90.03) v2(93.43,84.24) v2(93.43,83.48) v2(93.43,82.72) v2(93.43,81.95) v2(93.43,81.19) v2(93.71,93.08) v2(93.71,92.32) v2(93.71,91.55) v2(93.71,90.79) v2(93.71,90.03) v2(94.2,84.24) v2(94.2,83.48) v2(94.2,82.72) v2(94.2,81.95) v2(94.2,81.19) v2(94.48,93.08) v2(94.48,92.32) v2(94.48,91.55) v2(94.48,90.79) v2(94.48,90.03) v2(94.96,84.24) v2(94.96,83.48) v2(94.96,82.72) v2(94.96,81.95) v2(94.96,81.19) v2(95.19,97.61) v2(95.19,96.85) v2(95.19,96.09) v2(95.19,95.33) v2(95.19,94.56) v2(95.24,93.08) v2(95.24,92.32) v2(95.24,91.55) v2(95.24,90.79) v2(95.24,90.03) v2(95.64,88.48) v2(95.64,87.72) v2(95.64,86.96) v2(95.64,86.19) v2(95.64,85.43) v2(95.95,97.61) v2(95.95,96.85) v2(95.95,96.09) v2(95.95,95.33) v2(95.95,94.56) v2(96.41,88.48) v2(96.41,87.72) v2(96.41,86.96) v2(96.41,86.19) v2(96.41,85.43) v2(96.71,97.61) v2(96.71,96.85) v2(96.71,96.09) v2(96.71,95.33) v2(96.71,94.56) v2(97.17,88.48) v2(97.17,87.72) v2(97.17,86.96) v2(97.17,86.19) v2(97.17,85.43) v2(97.47,97.61) v2(97.47,96.85) v2(97.47,96.09) v2(97.47,95.33) v2(97.47,94.56) v2(97.93,88.48) v2(97.93,87.72) v2(97.93,86.96) v2(97.93,86.19) v2(97.93,85.43) v2(98.24,97.61) v2(98.24,96.85) v2(98.24,96.09) v2(98.24,95.33) v2(98.24,94.56) v2(98.69,88.48) v2(98.69,87.72) v2(98.69,86.96) v2(98.69,86.19) v2(98.69,85.43)
(no net):
  vias: v1(2.97,78.33) v1(11.02,23.82) v1(88.98,23.82) v1(97.03,78.35)
A00: length 51.5
  Top Layer w0.152: v2(45.99,84.57) 43.78,84.57 41.45,86.9 U6.7 ; v2(66.08,84.62) 69.56,84.62 71.59,82.59 U2.3
  Bottom Layer w0.152: v2(45.99,84.57) 46.04,84.62 v2(66.08,84.62)
A01: length 83.4
  Top Layer w0.152: v2(71.56,61.86) 71.56,66.48 U2.4 ; U6.1 26.21,83.38 24.61,81.79 24.61,62.05 v2(24.6,62.04)
  Bottom Layer w0.152: v2(71.56,61.86) 71.34,61.63 25.01,61.63 v2(24.6,62.04)
A02: length 110.5
  Top Layer w0.152: U2.1 75.43,67.75 v2(75.43,60.85) ; 25.46,18.8 25.46,14.52 26.58,13.4 74.79,13.4 75.43,14.03 v2(75.43,14.9)
  Bottom Layer w0.152: v2(75.43,14.9) v2(75.43,60.85)
A03: length 75.3
  Top Layer w0.152: v2(68.06,60.92) 68.06,65.52 U2.6 ; 40.7,18.8 41.96,17.54 64.71,17.54 65.04,17.87 v2(65.04,18.86)
  Bottom Layer w0.152: v2(68.06,60.92) 68.06,44.39 65.06,41.39 65.06,33.99 65.1,33.96 65.1,30.48 65.04,30.42 v2(65.04,18.86)
A04: length 36.6
  Top Layer w0.152: v2(83.78,67.81) 84.65,66.94 84.65,63.33 85.23,62.75 97.57,62.75 98.26,63.44 98.26,65.82 U18.1
  Bottom Layer w0.152: U2.5 70.29,67.81 v2(83.78,67.81)
A05: length 47.1
  Top Layer w0.152: U2.8 66.51,61.05 67.47,60.08 98.46,60.08 99.56,61.18 99.56,67.07 U18.2
A06: length 43.4
  Top Layer w0.152: U18.3 99.05,70.93 99.45,71.34 99.45,75.09 99.02,75.53 v2(88.74,75.53)
  Bottom Layer w0.152: U2.7 66.59,69.13 66.59,71.08 67.25,71.74 82.77,71.74 83.58,72.56 83.58,74.84 84.26,75.53 v2(88.74,75.53)
A07: length 33.7
  Top Layer w0.152: v2(87.74,65.85) U17.1
  Bottom Layer w0.152: v2(87.74,65.85) 85.33,65.85 84.11,64.63 64.5,64.63 63.97,65.16 U2.10
A08: length 87
  Top Layer w0.152: U1.34 32.25,32.19 32.25,37.3 33.57,38.62 v2(33.57,41.87) ; v2(54.22,56.88) 54.94,57.61 54.94,86.97 55.74,87.77 61.43,87.77 62.24,88.58 H13.2
  Bottom Layer w0.152: v2(33.57,41.87) 33.57,55.66 34.79,56.88 v2(54.22,56.88)
A15: length 48.9
  Top Layer w0.152: v2(36.6,10.94) 36.6,7.37 37.12,6.85 v2(40.93,6.85)
  Bottom Layer w0.152: v2(36.6,10.94) 36.6,20.24 36.21,20.64 34.86,20.64 33.2,22.3 33.2,27.46 34.61,28.87 34.61,30.47 34.62,30.48 34.62,31.42 34.61,31.43 34.61,32.37 U1.33 ; U9.3 53.61,4.1 53.61,5.96 52.72,6.85 v2(40.93,6.85)
B00: length 41.6
  Top Layer w0.152: U2.11 61.43,70.19 62.29,71.06 v2(64.15,71.06) ; U17.4 95.42,73.7 87.92,73.7 87.57,74.05 v2(87.57,76.09)
  Bottom Layer w0.152: v2(64.15,71.06) 65.8,71.06 66.92,72.17 81.93,72.17 82.84,73.09 82.84,75.35 83.83,76.34 87.31,76.34 87.55,76.1
B01: length 45.2
  Top Layer w0.152: U16.2 92.88,56.83 92.47,56.43 v2(67.04,56.43) ; v2(58.89,56.93) U2.14
  Bottom Layer w0.152: v2(67.04,56.43) 59.4,56.43 v2(58.89,56.93)
B04: length 51.9
  Top Layer w0.152: U1.25 44.08,33.49 44.92,32.65 v2(44.92,30.01) ; v2(46.42,21.04) 46.42,22.97 v2(46.37,23.03) ; v2(53.91,12.71) 62.8,12.71 65.65,9.87 69.18,9.87 v2(69.74,9.31)
  Bottom Layer w0.152: v2(53.91,12.71) 46.85,12.71 46.42,13.14 v2(46.42,21.04) ; v2(46.37,23.03) 46.37,28.56 v2(44.92,30.01) ; v2(69.74,9.31) 69.74,4.1 U11.1
B05: length 50.1
  Top Layer w0.152: v2(65.8,14.29) 65.8,21.43 65.06,22.16 53.3,22.16 52.44,23.03 v2(47.82,23.03) ; 72.25,9 72.25,10.2 71.51,10.94 66.74,10.94 65.8,11.87 v2(65.8,12.84)
  Bottom Layer w0.152: v2(72.25,9.04) U11.2 ; v2(47.82,23.03) 47.82,29.32 U1.24 ; v2(65.8,14.29) v2(65.8,12.84)
B06: length 64.9
  Top Layer w0.152: v2(28.54,35.8) 15.13,35.8 13.88,34.56 13.88,14.93 10.89,11.94 U3.3 ; v2(37.15,35.8) 37.2,35.75 v2(39.21,35.75)
  Bottom Layer w0.152: U1.23 46.19,35.17 45.61,35.75 v2(39.21,35.75) ; v2(28.54,35.8) v2(37.15,35.8)
B07: length 55.3
  Top Layer w0.152: v2(34.25,22.38) 22,22.38 13.43,13.82 U3.4
  Bottom Layer w0.152: U1.22 48.73,22.9 48.22,22.38 v2(34.25,22.38)
B08: length 28
  Top Layer w0.152: v2(34.91,27.93) 34.91,23.86 35.62,23.16 U5.5
  Bottom Layer w0.152: v2(34.91,27.93) 34.9,27.94 34.9,32.02 35.05,32.17 47.41,32.17 U1.21
B09: length 24.1
  Top Layer w0.152: v2(51.27,22.14) 51.27,20.71 50.63,20.08 39.44,20.08 U5.6
  Bottom Layer w0.152: v2(51.27,22.14) U1.20
B10: length 73.5
  Top Layer w0.152: v2(20.79,72.1) 11.04,72.1 9.11,70.17 9.11,47.07 H2.3
  Bottom Layer w0.152: v2(20.79,72.1) 44.95,72.1 46.19,70.85 U2.23
B11: length 67.3
  Top Layer w0.152: v2(24.73,54.93) 22.47,54.93 21.63,54.09 11.49,54.09 9.92,52.51 9.92,45.35 H2.2 ; v2(46.29,56.2) 46.29,66.41 U2.24 ; v2(31.84,54.93) v2(35.75,54.93)
  Bottom Layer w0.152: v2(46.29,56.2) 46.29,55.41 45.81,54.93 v2(35.75,54.93) ; v2(24.73,54.93) v2(31.84,54.93)
B12: length 57.5
  Top Layer w0.152: v2(23.38,96.61) 38.77,96.61 39.99,95.39 39.99,82.94 42.74,80.2 42.74,77.18 42.43,76.87 42.43,67.73 U2.26
  Bottom Layer w0.152: U15.3 22.29,89.83 22.29,95.67 23.23,96.61 v2(23.38,96.61)
B13: length 61.7
  Top Layer w0.152: v2(21.32,96.53) 22.01,97.22 38.93,97.22 40.42,95.72 40.42,84.11 45.17,79.36 45.17,70.27 43.95,69.05 U2.25
  Bottom Layer w0.152: U15.2 19.34,86.83 19.34,94.55 v2(21.32,96.53)
B14: length 52.3
  Top Layer w0.152: U2.28 41.21,66.41 v2(41.21,59.42) ; H7.3 3.81,51.6 7.3,51.6 7.94,52.23 7.94,55.66 v2(8.42,56.15)
  Bottom Layer w0.152: v2(8.42,56.15) 9.17,56.15 10.9,57.89 40.31,57.89 41.21,58.79 v2(41.21,59.42)
B15: length 43.4
  Top Layer w0.152: v2(8.45,65.12) 8.45,62.85 7.85,62.26 H6.3
  Bottom Layer w0.152: U2.27 41.11,68.34 40.55,67.78 23.43,67.78 21.16,65.51 8.83,65.51 v2(8.45,65.12)
BAT: length 48.8
  Top Layer w0.152: v2(45.07,24.47) 54.27,24.47 54.6,24.14 v2(54.6,23.51) ; v2(54.6,11.04) 54.6,9.64 54.98,9.26 v2(66.13,9.26)
  Bottom Layer w0.152: v2(66.13,9.26) 66.71,8.67 66.71,4.08 ; v2(54.6,23.51) v2(54.6,11.04) ; v2(45.07,24.47) 44.23,24.47 43.65,25.06 U1.26
C00: length 41
  Top Layer w0.152: v2(74.79,9.13) 74.79,9.94 v2(73.27,11.47)
  Bottom Layer w0.152: v2(73.27,11.47) 60.41,11.47 58.89,12.99 U1.14 ; v2(74.79,9.13) U11.3
C01: length 47.7
  Bottom Layer w0.152: U11.4 77.33,9.33 76.19,10.48 59.76,10.48 57.62,12.62 57.62,32.22 U1.15
C02: length 77.3
  Top Layer w0.152: H1.2 7.4,11.85 v2(7.4,11.85)
  Bottom Layer w0.152: U1.16 56.35,11.93 54.8,10.38 8.88,10.38 v2(7.4,11.85)
C03: length 42.2
  Top Layer w0.152: v2(65.9,36.69) 54.27,36.69 53.81,36.23 U1.17 ; v2(74.82,36.69) v2(85.76,36.69)
  Bottom Layer w0.152: v2(85.76,36.69) 91.07,36.69 H14.1 ; v2(65.9,36.69) v2(74.82,36.69)
C04: length 55.1
  Top Layer w0.152: U2.9 62.75,67.83 v2(62.75,58.38) ; v2(89.04,59.35) 89.04,58.94 88.03,57.93 v2(67.04,57.93)
  Bottom Layer w0.152: v2(62.75,58.38) 63.2,57.93 v2(67.04,57.93) ; U17.3 91.71,70.93 91.12,70.35 91.12,66.15 89.04,64.07 v2(89.04,59.35)
C05: length 51.5
  Top Layer w0.152: v2(89.42,68.8) 89.83,68.39 U17.2 ; U2.12 61.43,66.84 60.29,67.98 60.29,70.55 62.24,72.5 v2(64.17,72.5)
  Bottom Layer w0.152: v2(89.42,68.8) 89.42,76.47 89.21,76.67 83.51,76.67 82.26,75.43 82.26,73.42 81.34,72.5 v2(64.17,72.5)
C06: length 44.2
  Top Layer w0.152: v2(41.95,6.11) 35.12,6.11 34.63,6.59 v2(34.63,11.98)
  Bottom Layer w0.152: v2(41.95,6.11) 47.92,6.11 48.53,5.5 48.53,4.1 U9.1 ; U1.35 31.86,32.58 31.86,31.81 32.19,31.48 32.19,22.49 34.64,20.05 34.64,11.98 v2(34.63,11.98)
C07: length 46.5
  Top Layer w0.152: v2(34.05,12.64) 34.05,6.11 34.68,5.47 v2(40.93,5.47)
  Bottom Layer w0.152: U1.36 30.95,23 34.06,19.89 34.06,12.65 v2(34.05,12.64) ; v2(40.93,5.47) 45.17,5.47 45.76,4.89 45.76,3.24 46.19,2.81 50.69,2.81 51.04,3.16 U9.2
C08: length 40.2
  Bottom Layer w0.152: U12.3 85.41,10.93 82.33,14.01 73.77,14.01 72.85,14.94 72.85,31.42 72.33,31.94 72.33,32.75 U1.3
C09: length 65.6
  Top Layer w0.152: U1.2 72.81,32.27 72.81,34.23 72.22,34.81 68.11,34.81 67.07,35.85 67.07,48.98 65.24,50.81 65.24,71.77 64.78,72.22 H13.3
C10: length 63.1
  Top Layer w0.152: 51.25,83.45 52.54,82.16 52.54,51.14 53.68,50 65.29,50 66.51,48.78 U1.7
C11: length 71.2
  Top Layer w0.152: 48.71,83.32 49.97,82.06 49.97,32.55 50.36,32.17 68.16,32.17 69.05,31.28 U1.6
C12: length 44.8
  Top Layer w0.152: v2(71.59,26.18) 71.59,17.59 72.86,16.32 95.14,16.32 97.14,14.31 97.14,11.58 U8.3
  Bottom Layer w0.152: v2(71.59,26.18) U1.4
C13: length 41.5
  Bottom Layer w0.152: U12.2 82.87,11.39 81.32,12.94 67.83,12.94 66.51,14.26 U1.8
D00: length 45.4
  Top Layer w0.152: v2(41.95,7.43) 37.71,7.43 37.15,7.99 v2(37.15,11.87) ; v2(37.15,16.6) 37.15,22.97 v2(37.13,22.99)
  Bottom Layer w0.152: U1.32 36.03,24.09 v2(37.13,22.99) ; v2(41.95,7.43) 55.08,7.43 56.12,6.39 U9.4 ; v2(37.15,16.6) v2(37.15,11.87)
D01: length 49.3
  Top Layer w0.152: v2(57.04,24.7) 57.04,25.46 56.32,26.18 v2(41.24,26.18) ; v2(37.38,29.12) 37.38,32.14 U1.31
  Bottom Layer w0.152: 59.09,5.45 57.04,7.51 v2(57.04,24.7) ; 59.09,5.45 59.09,4.08 ; v2(41.24,26.18) 38.7,26.18 37.38,27.5 v2(37.38,29.12)
D02: length 44.6
  Top Layer w0.152: v2(70.32,28.99) 70.32,32.22 U1.5 ; U8.4 93.13,15.66 71.44,15.66 70.12,16.98 v2(70.12,26.2)
  Bottom Layer w0.152: v2(70.12,26.2) 70.12,28.21 70.32,28.41 v2(70.32,28.99)
D03: length 41.2
  Top Layer w0.152: U1.1 84.54,33.49 85.61,32.42 v2(85.61,30.24)
  Bottom Layer w0.152: U12.4 87.95,9.66 85.61,12 v2(85.61,30.24)
D04: length 46.5
  Top Layer w0.152: 61.63,4.08 60.36,5.35 57.98,5.35 v2(56.88,6.44) ; v2(55.82,10.32) 55.26,10.88 v2(55.26,11.95) ; v2(55.38,22.92) 55.38,24.78 54.88,25.29 40.2,25.29 38.57,26.91 v2(38.57,27.75)
  Bottom Layer w0.152: v2(55.82,10.32) 55.82,7.51 v2(56.88,6.44) ; v2(55.38,22.92) 55.38,12.08 v2(55.26,11.95) ; U1.30 v2(38.57,27.75)
D05: length 75.9
  Top Layer w0.152: v2(38.6,41.34) 38.57,41.31 v2(38.57,38.82) ; v2(66.15,54.42) 91.85,54.42 H3.4
  Bottom Layer w0.152: v2(38.57,38.82) U1.29 ; v2(66.15,54.42) 39.18,54.42 38.6,53.84 v2(38.6,41.34)
D06: length 76.7
  Top Layer w0.152: v2(41.3,27.79) 41.67,27.42 87.75,27.42 89.45,29.12 89.45,49.28 90.73,50.55 H3.3
  Bottom Layer w0.152: U1.28 41.3,30.76 v2(41.3,27.79)
D07: length 49.2
  Top Layer w0.152: v2(64.17,6.82) U10.3 ; U1.27 41.39,33.49 42.35,32.53 v2(42.35,30.01) ; v2(42.35,23.05) v2(44.44,20.97) ; v2(44.44,12.15) 44.44,9.39 45.1,8.72 v2(62.27,8.72)
  Bottom Layer w0.152: v2(44.44,20.97) v2(44.44,12.15) ; v2(62.27,8.72) v2(64.17,6.82) ; v2(42.35,30.01) v2(42.35,23.05)
D08: length 40.6
  Top Layer w0.152: U15.1 21.78,83.05 22.35,82.47 v2(22.35,63.27)
  Bottom Layer w0.152: v2(22.35,63.27) 22.67,62.95 37.68,62.95 38.57,63.84 U2.30
D09: length 43.8
  Top Layer w0.152: U14.4 15.66,90.64 16.85,89.45 16.85,82.18 18.56,80.48 18.56,76.73 v2(19,76.29)
  Bottom Layer w0.152: v2(19,76.29) 19.62,75.67 19.62,72.1 20.38,71.34 38.11,71.34 38.57,70.88 U2.29
D10: length 58.4
  Top Layer w0.152: U2.32 34.76,67.78 32.83,67.78 32.25,68.36 32.25,69.61 32.85,70.21 32.85,94.19 32.36,94.68 v2(15.1,94.68)
  Bottom Layer w0.152: v2(15.1,94.68) 14.59,94.17 14.59,86.83 U14.2
D11: length 56.5
  Top Layer w0.152: v2(15.1,95.97) 34.1,95.97 35.37,94.7 35.37,70.42 36.03,69.76 U2.31
  Bottom Layer w0.152: v2(15.1,95.97) 14.8,95.97 12.08,93.26 12.08,89.34 U14.3
D12: length 48.9
  Top Layer w0.152: v2(30.62,58.56) 32.96,58.56 33.49,59.09 U2.34 ; v2(21.75,59.19) 21.75,72.66 21.27,73.14 17.92,73.14 16.78,74.28 16.78,79.57 U14.1
  Bottom Layer w0.152: v2(21.75,59.19) 22.39,58.56 v2(30.62,58.56)
D13: length 69.3
  Top Layer w0.152: U2.33 34.91,70.47 34.91,94.22 33.74,95.39 v2(12.43,95.39)
  Bottom Layer w0.152: U13.2 1.59,87.14 1.59,93.79 3.19,95.39 v2(12.43,95.39)
D14: length 59.8
  Bottom Layer w0.152: U2.36 30.95,64.66 30.37,64.07 20.05,64.07 19.16,63.18 5.93,63.18 5.35,62.6 5.35,60.34 5.09,60.08 1.44,60.08 0.65,60.87 0.65,81.95 1.59,82.89 U13.1
D15: length 61.9
  Top Layer w0.152: U2.35 32.47,70.57 32.47,93.33 31.76,94.04 v2(11.44,94.04)
  Bottom Layer w0.152: v2(11.44,94.04) 2.68,94.04 1.98,93.34 1.98,89.28 U13.3
E00: length 47.2
  Top Layer w0.152: U5.2 28,15.51 28.87,14.64 51.83,14.64 52.11,14.92 v2(52.11,15.38)
  Bottom Layer w0.152: U1.19 52.59,32.17 52.59,24.19 52.11,23.71 v2(52.11,15.38)
E01: length 40.5
  Top Layer w0.152: v2(53.89,16.9) 53.89,16.4 53.5,16.01 31.15,16.01 30.54,16.63 U5.3
  Bottom Layer w0.152: v2(53.89,16.9) 53.89,30.87 U1.18
E02: length 90.7
  Top Layer w0.152: U6.2 28.75,81.71 27.5,80.45 27.5,72.35 27.14,72 27.14,40.53 27.67,39.99 v2(28.56,39.99) ; U1.13 58.89,35.22 v2(58.92,35.24)
  Bottom Layer w0.152: v2(28.56,39.99) 57.62,39.99 58.92,38.7 v2(58.92,35.24)
E03: length 98
  Top Layer w0.152: U6.3 31.29,83.13 30.11,81.95 30.11,72.02 29.68,71.59 29.68,29.4 30.57,28.51 v2(59.68,28.51)
  Bottom Layer w0.152: U1.12 61.4,30.92 61.4,29.55 60.36,28.51 v2(59.68,28.51)
E04: length 83.1
  Top Layer w0.152: v2(55.13,35.93) 60.87,35.93 61.46,35.34 61.46,33.52 U1.11 ; U6.5 36.37,82.66 37.66,81.37 37.66,71.95 37.25,71.54 37.25,37.43 37.78,36.89 v2(39.21,36.89)
  Bottom Layer w0.152: v2(55.13,35.93) 52.08,35.93 51.12,36.89 v2(39.21,36.89)
E05: length 89.5
  Top Layer w0.152: U6.6 38.91,82.53 40.15,81.29 40.15,72.22 39.84,71.92 39.84,29.71 40.3,29.25 63.51,29.25 63.97,29.71 U1.10
E06: length 46.1
  Bottom Layer w0.152: U1.9 62.7,32.22 62.7,14.13 64.63,12.21 79.72,12.21 80.33,11.59 U12.1
E07: length 42.9
  Top Layer w0.152: U2.13 59.91,68.03 59.91,67.42 60.16,67.17 v2(60.16,57.85) ; U16.1 90.34,57.44 90.08,57.19 v2(66,57.19)
  Bottom Layer w0.152: v2(66,57.19) 60.82,57.19 v2(60.16,57.85)
E08: length 55.1
  Top Layer w0.152: v2(67.09,55.11) 97.35,55.11 97.96,55.72 U16.4 ; U2.16 56.35,55.97 57.21,55.11 v2(58.31,55.11)
  Bottom Layer w0.152: v2(58.31,55.11) v2(67.09,55.11)
E09: length 53.7
  Top Layer w0.152: U2.15 57.14,69.05 57.76,68.43 57.76,56.26 v2(57.77,56.25) ; v2(65.98,55.74) 94.86,55.74 95.41,56.3 U16.3
  Bottom Layer w0.152: v2(57.77,56.25) 58.28,55.74 v2(65.98,55.74)
E10: length 56.4
  Top Layer w0.152: U15.4 19.52,90.67 18.94,90.08 18.94,77.45 v2(20.23,76.16)
  Bottom Layer w0.152: U2.18 52.51,67.81 52.51,70.85 52.41,70.96 52.38,70.96 52.08,71.26 46.34,71.26 45,72.61 22.69,72.61 20.23,75.07 v2(20.23,76.16)
E11: length 61.8
  Top Layer w0.152: U2.17 v2(53.81,72.15) ; CN2.1 89.5,77.81 88.96,77.28 v2(88.15,77.28)
  Bottom Layer w0.152: v2(88.15,77.28) 54.52,77.28 53.81,76.57 v2(53.81,72.15)
E12: length 69.6
  Top Layer w0.152: v2(85.87,63.79) 86.96,64.88 CN2.2
  Bottom Layer w0.152: U2.20 51.24,66.48 51.24,64.22 51.63,63.84 69.38,63.84 v2(69.43,63.79) v2(85.87,63.79)
E13: length 58
  Top Layer w0.152: v2(51.27,72.15) U2.19 ; CN2.3 84.42,80 82.59,78.17 v2(73.55,78.17)
  Bottom Layer w0.152: v2(73.55,78.17) 53.96,78.17 53.2,77.41 53.2,75.27 53.09,75.17 51.87,75.17 51.27,74.56 v2(51.27,72.15)
E14: length 62.3
  Top Layer w0.152: v2(73.57,79.06) 80.35,79.06 81.88,80.58 CN2.4 ; U2.22 47.46,67.78 v2(47.46,72.2)
  Bottom Layer w0.152: v2(47.46,72.2) 47.46,75.65 47.84,76.03 50.71,76.03 51.3,76.62 51.3,78.22 52.13,79.06 v2(73.57,79.06)
E15: length 56.4
  Top Layer w0.152: v2(48.73,77.03) U2.21 ; CN2.5 79.34,80.76 78.42,79.84 v2(73.57,79.84)
  Bottom Layer w0.152: v2(73.57,79.84) 49.57,79.84 48.73,79.01 v2(48.73,77.03)
O5V: length 126.3
  Top Layer w0.508: v2(17.64,79.84) v2(17.64,75.15)
  Top Layer w0.762: 61.96,98.06 74.59,98.06 CN2.6 ; 61.96,98.06 60.01,98.06 59.78,97.83 ; 61.96,98.06 arc(60.34,97.39) 59.68,95.78 ; v2(4.51,60.87) 4.51,56.38 3.81,55.68 H7.2 ; 59.78,97.83 59.68,97.83 59.68,95.78 ; 59.78,97.83 59.78,98.08 ; 59.68,95.78 59.68,90.31 H13.1
  Bottom Layer w0.508: 52.42,99.45 20.93,99.45 17.64,96.15 v2(17.64,79.84) ; 17.54,69.51 17.64,69.61 v2(17.64,75.15)
  Bottom Layer w0.762: 17.54,66.92 17.54,69.51 7.96,69.51 6.01,67.55 6.01,66.22 4.59,64.8 ; 4.48,63.26 4.51,63.24 v2(4.51,60.87) ; 4.48,63.26 4.48,64.7 4.59,64.8 ; 4.48,63.26 arc(4.03,64.35) 2.95,64.8 ; 2.95,64.8 4.59,64.8 ; 2.95,64.8 H6.2
O7V: length 90.8
  Top Layer w0.762: v2(25.26,8.72) 25.26,11.57 21.32,15.51 v2(15.91,15.51) ; v2(7.28,59.42) 6.36,58.51 v2(6.36,52.49)
  Bottom Layer w0.762: v2(15.91,15.51) 14.84,15.51 6.36,23.98 v2(6.36,52.49) ; v2(25.26,8.72) 25.26,3.9 25.46,3.7 ; 11.85,59.35 11.77,59.42 v2(7.28,59.42) ; U7.1 15.75,77.75 14.36,76.36 v2(14.36,70.42)
REF: length 32.1
  Top Layer w0.152: v2(88.18,74.89) 97.49,74.89 98.23,74.14 U18.4
  Bottom Layer w0.152: v2(88.18,74.89) 86.09,74.89 85.03,73.83 85.03,67.7 83.83,66.51 U2.2

## Copper pours and planes (outline as drawn; the poured copper is in the pictures)
O5V on Bottom Layer: 1.08,66.07 6.36,66.07 6.36,63.72 1.08,63.72

Small or netless copper shapes (teardrops, artwork), in the pictures only: 205 on Top Layer, 201 on Bottom Layer

## Text on the board
Top Silkscreen Layer: TX | RX | LED | 3V3 | O7V | O5V | GND | O | 0 | JY62 | HC06 | AGND | B06 | B07 | A02 | A01 | E00 | E02 | E01 | E03 | B08 | E04 | B09 | E05 | A03 | A00 | C11 | 超声波 | C10 | 05V | A08 | C09 | E15 | E14 | E13 | 二维码 | E12 | E11 | D06 | E07 | D05 | E08 | E09 | B01 | D15 | D14 | D13 | D12 | D11 | D10 | D09 | E10 | B12 | B13 | D08 | D02 | C12 | 标签朝外 | C02 | B15 | B14 | 朝里叫 | 5V0 | C06 | C07 | A15 | D01 | D00 | D04 | D07 | B04 | BAT | B05 | C03 | C01 | C00 | E06 | C13 | C08 | D03 | A07 | C05 | C04 | B00 | REF | A06 | A05 | A04 | B10 | B11 | 八根屁股针 | 摄像头 | BEEP | 按键 | OLED | TB6612 | 八路 | 五路 | 舵机
